# EAGLE board ALU V3.2 (EAGLE 9.6.2)
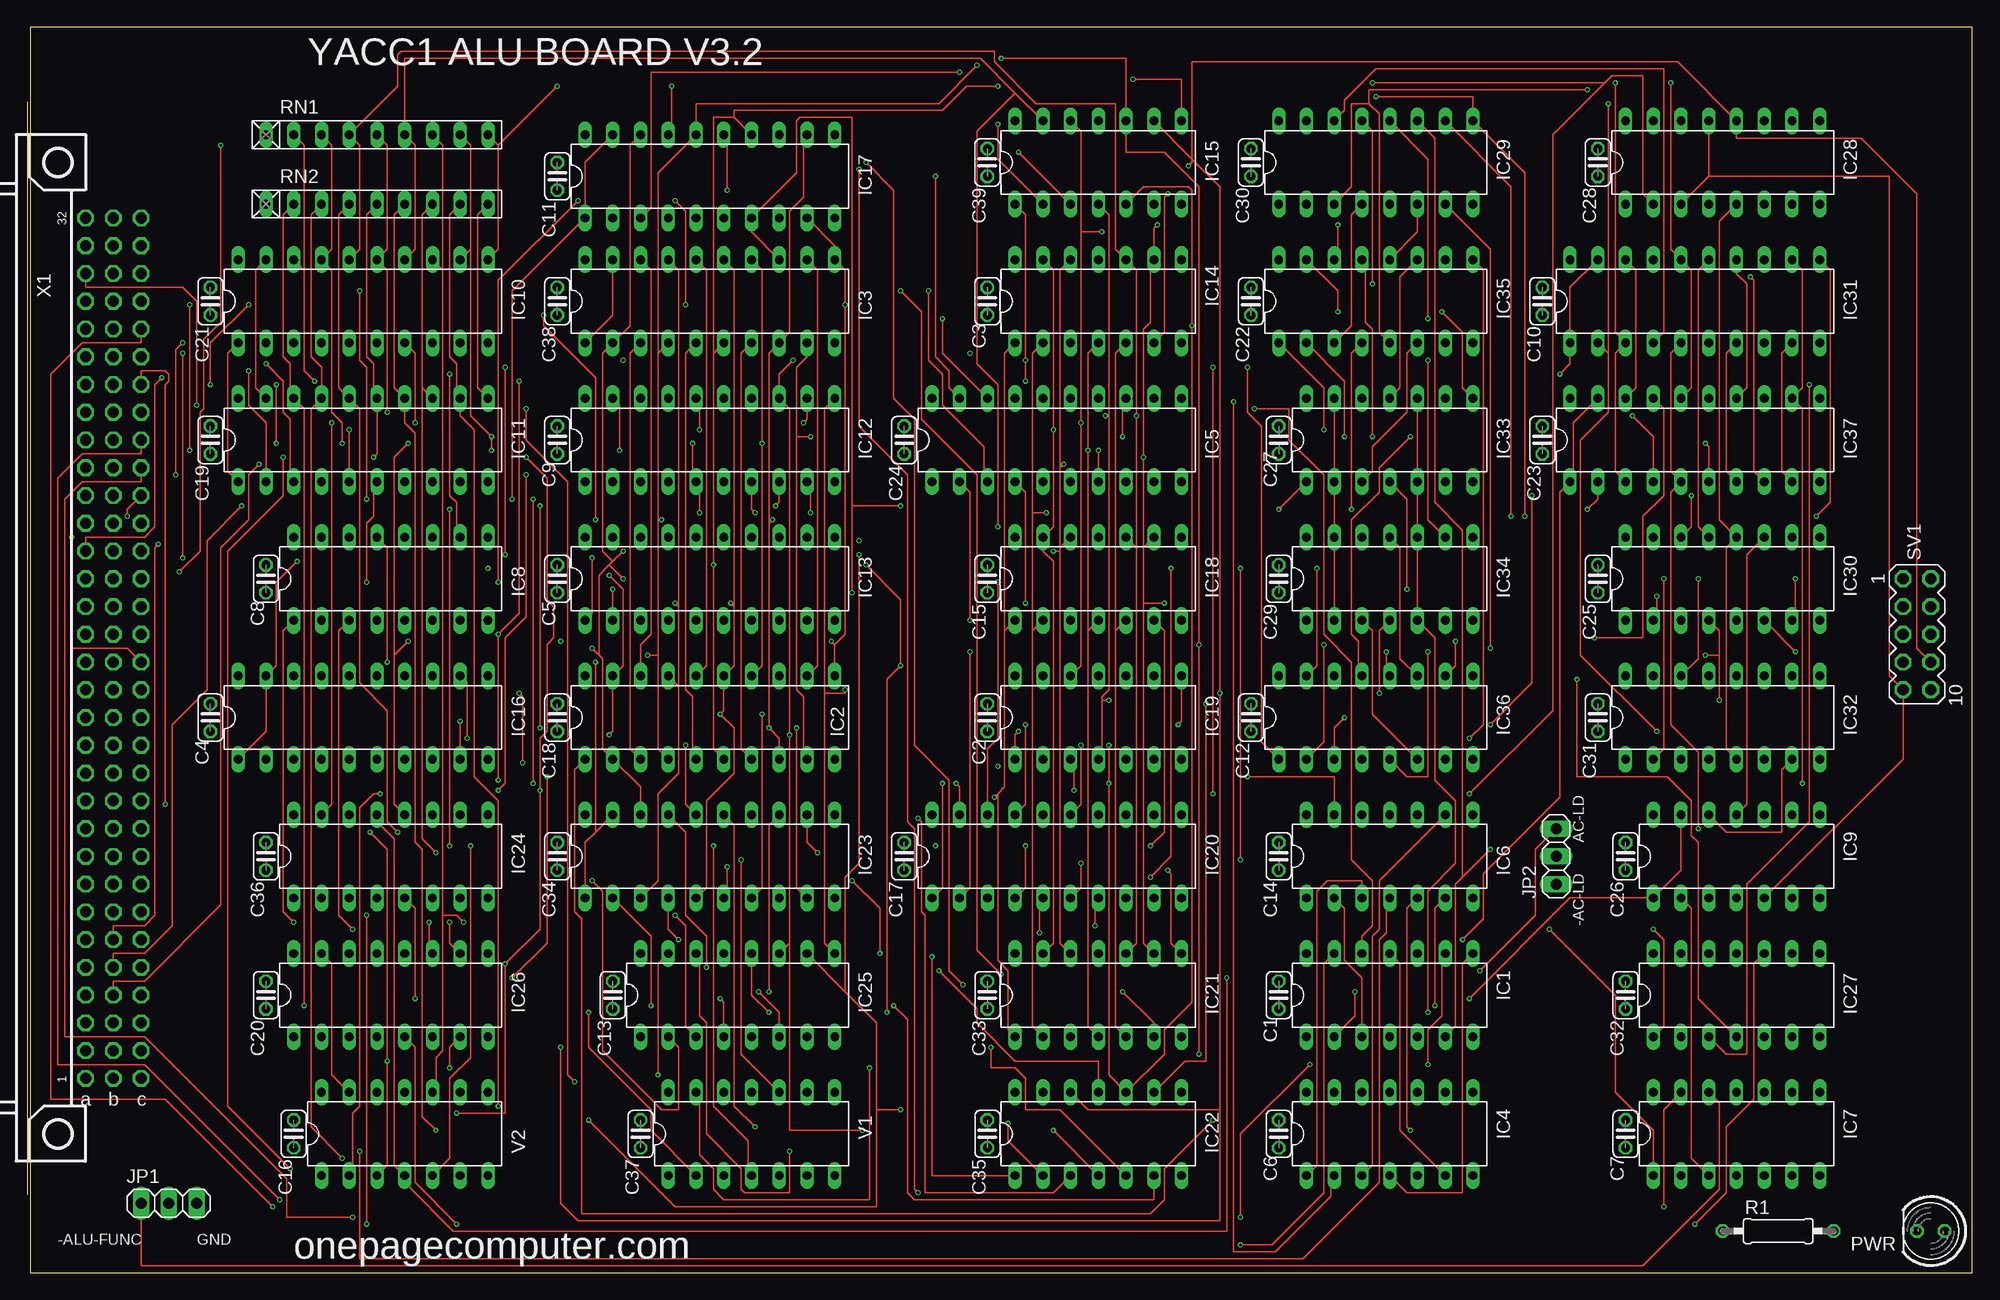
[diagram p9: board, top side]
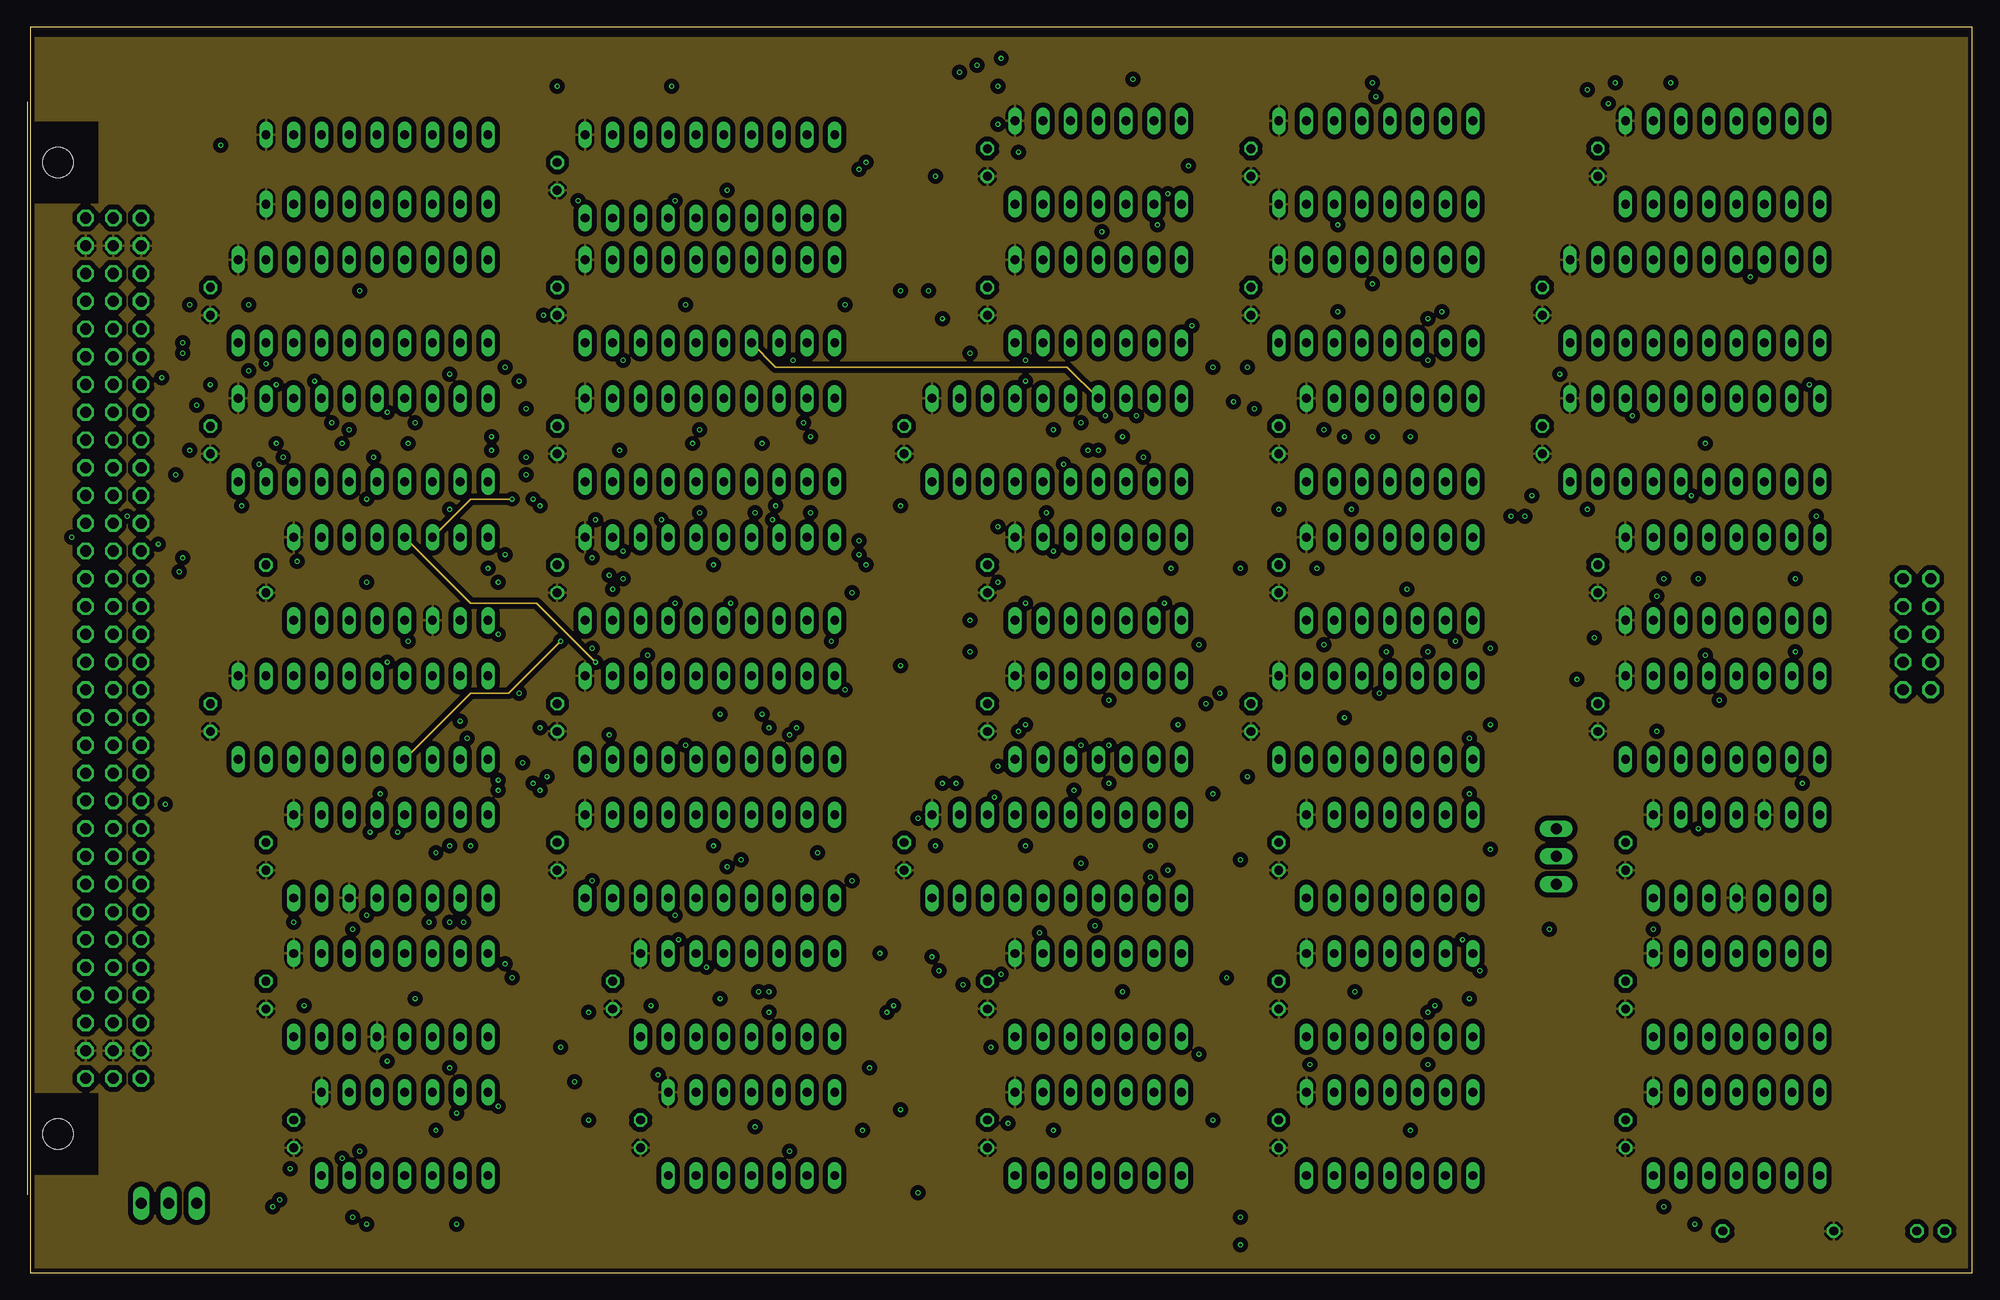
[diagram p10: board, inner layer Route2]
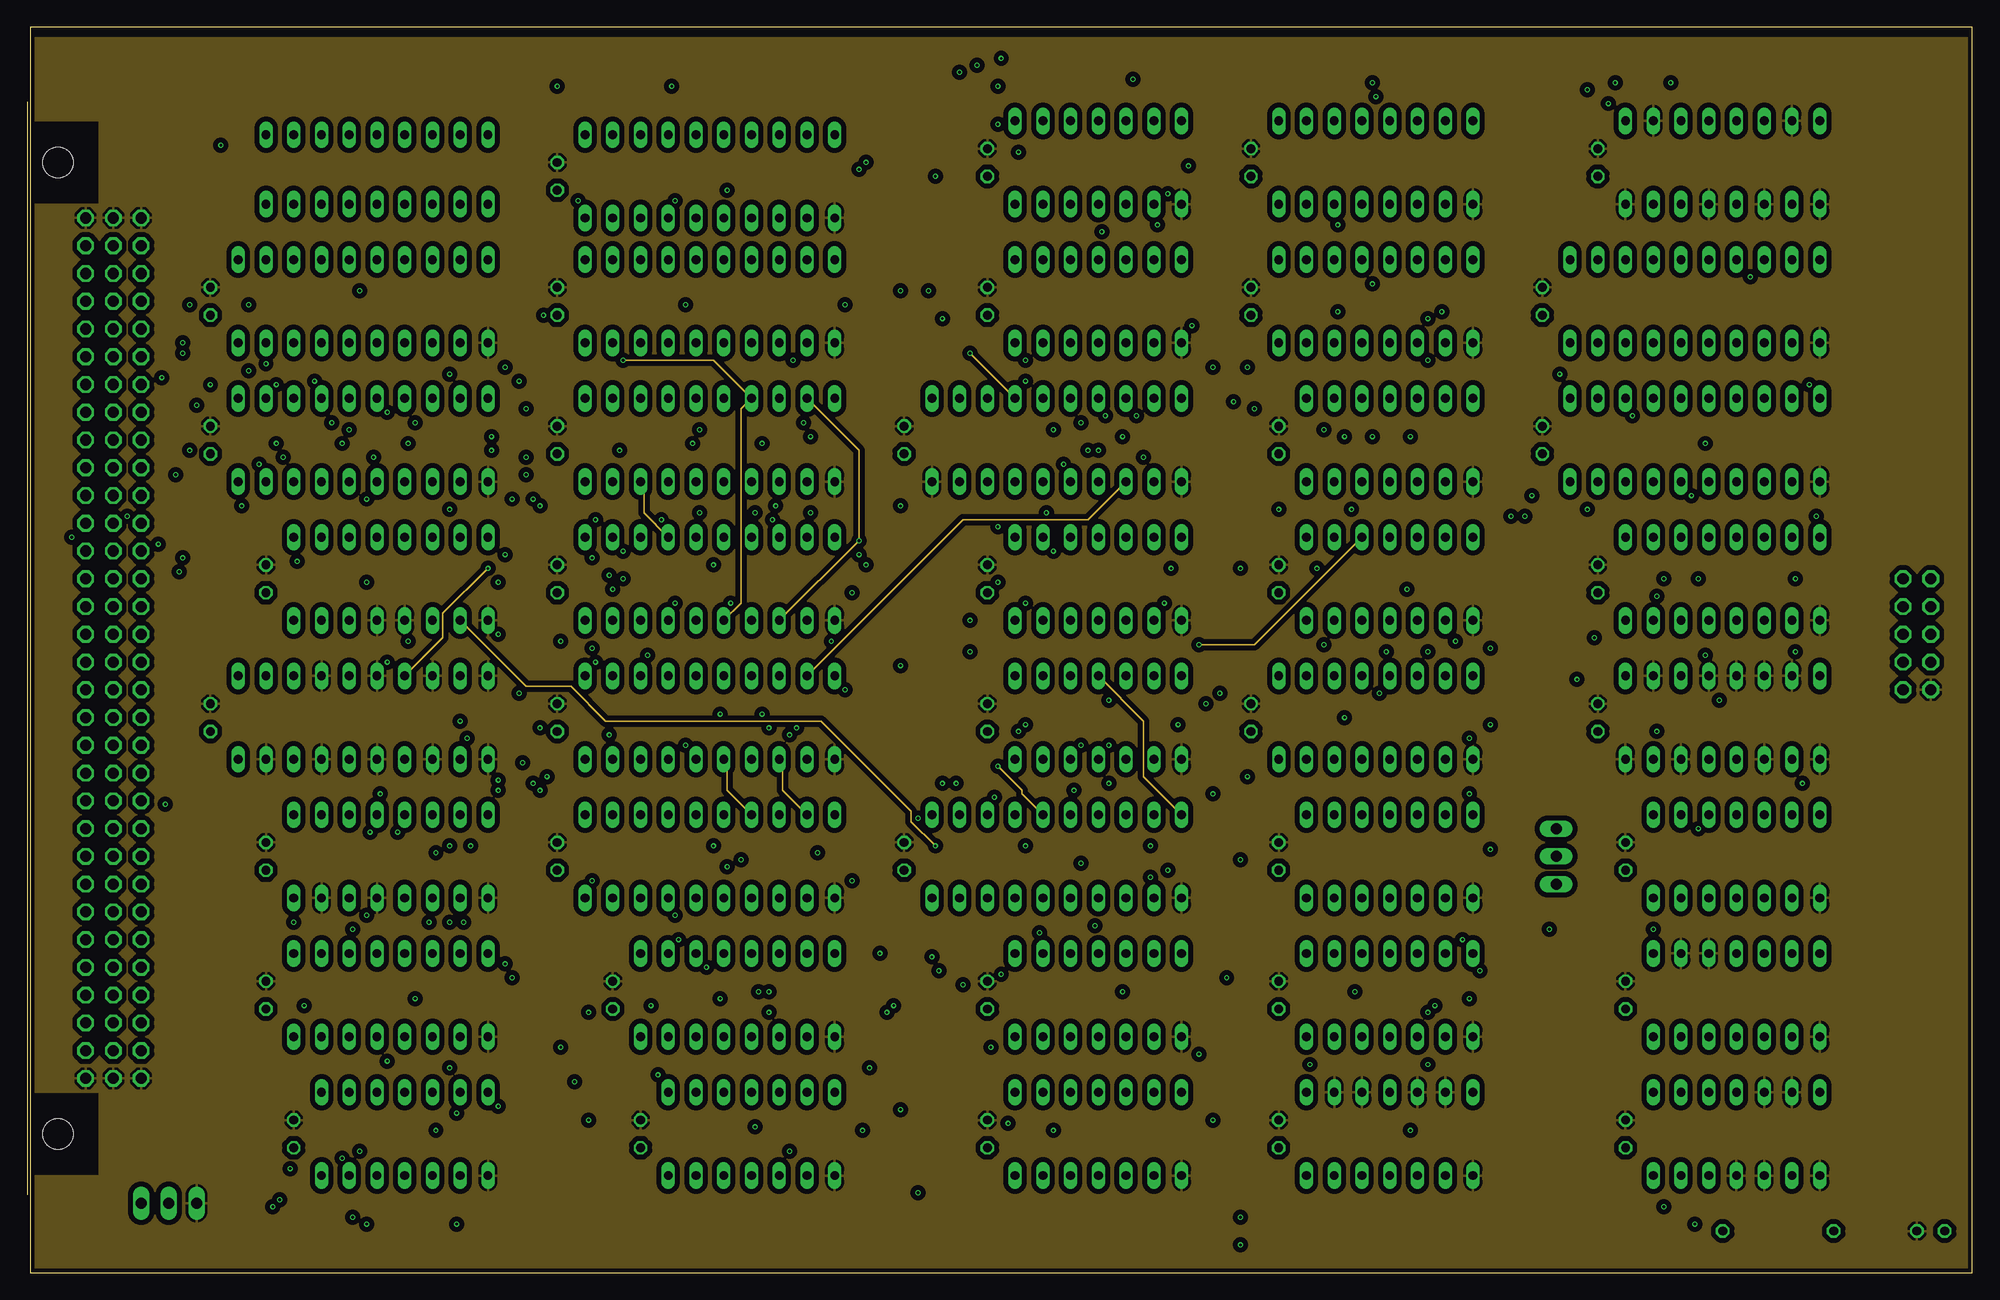
[diagram p11: board, inner layer Route15]
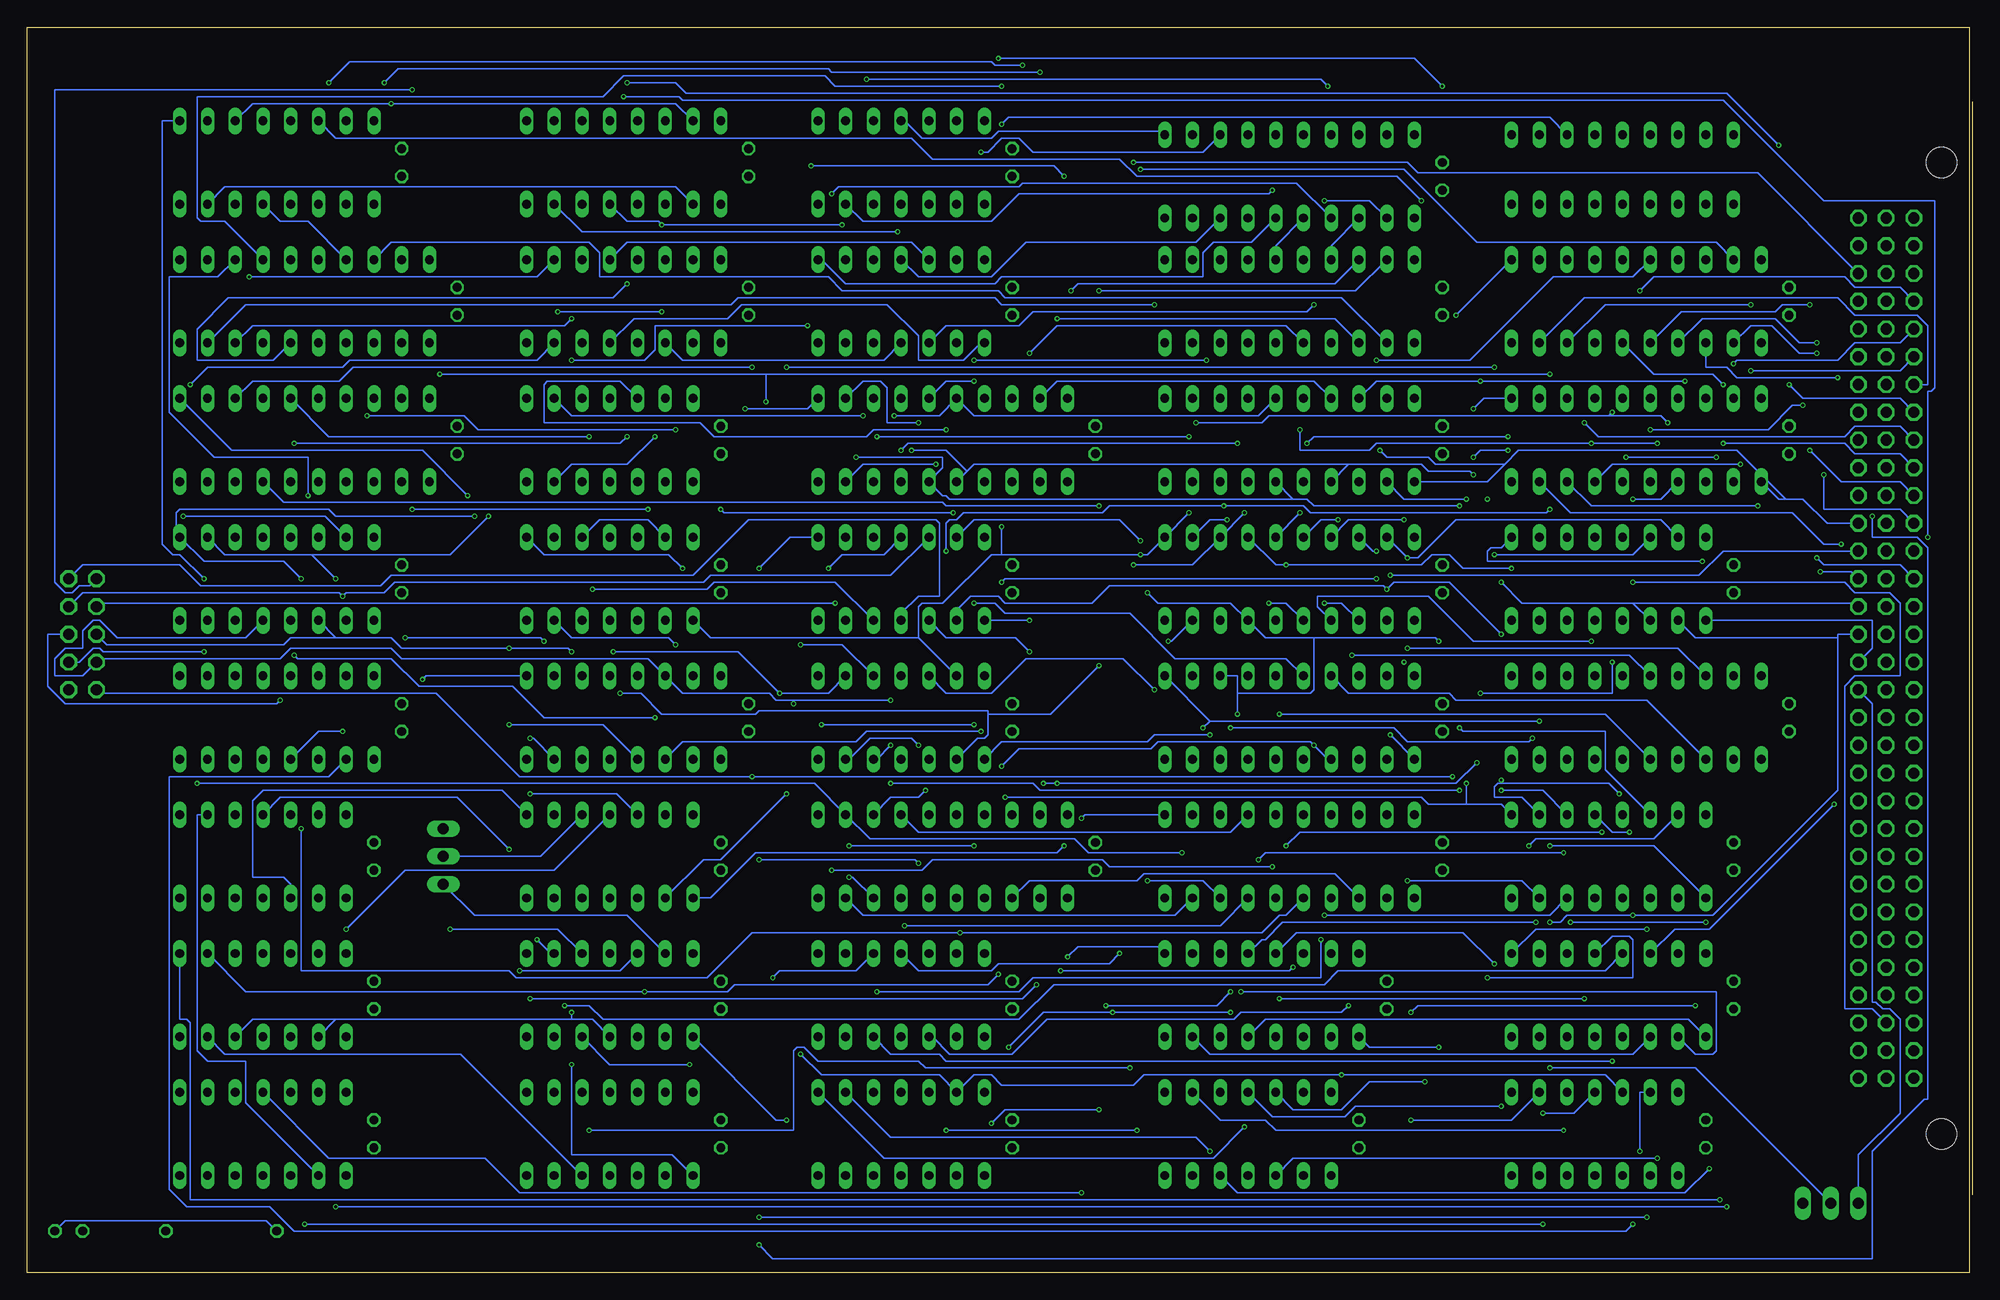
[diagram p12: board, bottom side, seen from below]

Size 177.78 x 113.97 mm. Coordinates in mm from the lower left corner, seen from the top.
Outline: 0,0 177.78,0 177.78,113.97 0,113.97 0,0
Copper layers (1*2*15*16): Top 0.035559375mm / dielectric 0.17018125mm / Route2 0.01778125mm / dielectric 47mil / Route15 0.01778125mm / dielectric 0.17018125mm / Bottom 0.035559375mm
Design rules "oshpark-4layer *": minimum track width 5mil, minimum drill 10mil, track to track 18mil, track to pad 10mil, pad to pad 5mil, via to via 5mil, smd to smd 5mil, copper to edge 15mil, drill to drill 6mil, minimum pad ring 4mil, minimum via ring 4mil, stop-mask expansion 2.5mil, vias tented up to drill 0mil, thermal gap 10mil

## Footprints (pad centres in the part's own frame; a part is rotated, then mirrored left to right if it is on the bottom)
C025-024X044 = drill 0.813 octagon: 1 -1.27,0; 2 1.27,0
DIL14 = drill 0.813 long: 1 -7.62,-3.81; 2 -5.08,-3.81; 3 -2.54,-3.81; 4 0,-3.81; 5 2.54,-3.81; 6 5.08,-3.81; 7 7.62,-3.81; 8 7.62,3.81; 9 5.08,3.81; 10 2.54,3.81; 11 0,3.81; 12 -2.54,3.81; 13 -5.08,3.81; 14 -7.62,3.81
DIL20 = drill 0.813 long: 1 -11.43,-3.81; 2 -8.89,-3.81; 3 -6.35,-3.81; 4 -3.81,-3.81; 5 -1.27,-3.81; 6 1.27,-3.81; 7 3.81,-3.81; 8 6.35,-3.81; 9 8.89,-3.81; 10 11.43,-3.81; 11 11.43,3.81; 12 8.89,3.81; 13 6.35,3.81; 14 3.81,3.81; 15 1.27,3.81; 16 -1.27,3.81; 17 -3.81,3.81; 18 -6.35,3.81; 19 -8.89,3.81; 20 -11.43,3.81
DIL16 = drill 0.813 long: 1 -8.89,-3.81; 2 -6.35,-3.81; 3 -3.81,-3.81; 4 -1.27,-3.81; 5 1.27,-3.81; 6 3.81,-3.81; 7 6.35,-3.81; 8 8.89,-3.81; 9 8.89,3.81; 10 6.35,3.81; 11 3.81,3.81; 12 1.27,3.81; 13 -1.27,3.81; 14 -3.81,3.81; 15 -6.35,3.81; 16 -8.89,3.81
1X03 = drill 1.016 long: 1 -2.54,0; 2 0,0; 3 2.54,0
LED5MM = drill 0.813 octagon: A -1.27,0; K 1.27,0
0207/10 = drill 0.813 octagon: 1 -5.08,0; 2 5.08,0
RN-9 = drill 0.813 long: 1 -10.16,0; 2 -7.62,0; 3 -5.08,0; 4 -2.54,0; 5 0,0; 6 2.54,0; 7 5.08,0; 8 7.62,0; 9 10.16,0
MA05-2 = drill 1.016 octagon: 1 -5.08,-1.27; 2 -5.08,1.27; 3 -2.54,-1.27; 4 -2.54,1.27; 5 0,-1.27; 6 0,1.27; 7 2.54,-1.27; 8 2.54,1.27; 9 5.08,-1.27; 10 5.08,1.27
FABC96R = drill 1.016 octagon: A1 -2.54,39.37; A2 -2.54,36.83; A3 -2.54,34.29; A4 -2.54,31.75; A5 -2.54,29.21; A6 -2.54,26.67; A7 -2.54,24.13; A8 -2.54,21.59; A9 -2.54,19.05; A10 -2.54,16.51; A11 -2.54,13.97; A12 -2.54,11.43; A13 -2.54,8.89; A14 -2.54,6.35; A15 -2.54,3.81; A16 -2.54,1.27; A17 -2.54,-1.27; A18 -2.54,-3.81; A19 -2.54,-6.35; A20 -2.54,-8.89; A21 -2.54,-11.43; A22 -2.54,-13.97; A23 -2.54,-16.51; A24 -2.54,-19.05; A25 -2.54,-21.59; A26 -2.54,-24.13; A27 -2.54,-26.67; A28 -2.54,-29.21; A29 -2.54,-31.75; A30 -2.54,-34.29; A31 -2.54,-36.83; A32 -2.54,-39.37; B1 -5.08,39.37; B2 -5.08,36.83; B3 -5.08,34.29; B4 -5.08,31.75; B5 -5.08,29.21; B6 -5.08,26.67; B7 -5.08,24.13; B8 -5.08,21.59; B9 -5.08,19.05; B10 -5.08,16.51; B11 -5.08,13.97; B12 -5.08,11.43; B13 -5.08,8.89; B14 -5.08,6.35; B15 -5.08,3.81; B16 -5.08,1.27; B17 -5.08,-1.27; B18 -5.08,-3.81; B19 -5.08,-6.35; B20 -5.08,-8.89; B21 -5.08,-11.43; B22 -5.08,-13.97; B23 -5.08,-16.51; B24 -5.08,-19.05; B25 -5.08,-21.59; B26 -5.08,-24.13; B27 -5.08,-26.67; B28 -5.08,-29.21; B29 -5.08,-31.75; B30 -5.08,-34.29; B31 -5.08,-36.83; B32 -5.08,-39.37; C1 -7.62,39.37; C2 -7.62,36.83; C3 -7.62,34.29; C4 -7.62,31.75; C5 -7.62,29.21; C6 -7.62,26.67; C7 -7.62,24.13; C8 -7.62,21.59; C9 -7.62,19.05; C10 -7.62,16.51; C11 -7.62,13.97; C12 -7.62,11.43; C13 -7.62,8.89; C14 -7.62,6.35; C15 -7.62,3.81; C16 -7.62,1.27; C17 -7.62,-1.27; C18 -7.62,-3.81; C19 -7.62,-6.35; C20 -7.62,-8.89; C21 -7.62,-11.43; C22 -7.62,-13.97; C23 -7.62,-16.51; C24 -7.62,-19.05; C25 -7.62,-21.59; C26 -7.62,-24.13; C27 -7.62,-26.67; C28 -7.62,-29.21; C29 -7.62,-31.75; C30 -7.62,-34.29; C31 -7.62,-36.83; C32 -7.62,-39.37 | hole 2.794: 0,-44.456; 0,44.456

## Placement (x,y rotation side)
C1  .1uf  [C025-024X044]  114.3,25.4 90 top
C2  .1uf  [C025-024X044]  87.63,50.8 90 top
C3  .1uf  [C025-024X044]  87.63,88.9 90 top
C4  .1uf  [C025-024X044]  16.51,50.8 90 top
C5  .1uf  [C025-024X044]  48.26,63.5 90 top
C6  .1uf  [C025-024X044]  114.3,12.7 90 top
C7  .1uf  [C025-024X044]  146.05,12.7 90 top
C8  .1uf  [C025-024X044]  21.59,63.5 90 top
C9  .1uf  [C025-024X044]  48.26,76.2 90 top
C10  .1uf  [C025-024X044]  138.43,88.9 90 top
C11  .1uf  [C025-024X044]  48.26,100.33 90 top
C12  .1uf  [C025-024X044]  111.76,50.8 90 top
C13  .1uf  [C025-024X044]  53.34,25.4 90 top
C14  .1uf  [C025-024X044]  114.3,38.1 90 top
C15  .1uf  [C025-024X044]  87.63,63.5 90 top
C16  .1uf  [C025-024X044]  24.13,12.7 90 top
C17  .1uf  [C025-024X044]  80.01,38.1 90 top
C18  .1uf  [C025-024X044]  48.26,50.8 90 top
C19  .1uf  [C025-024X044]  16.51,76.2 90 top
C20  .1uf  [C025-024X044]  21.59,25.4 90 top
C21  ,1uf  [C025-024X044]  16.51,88.9 90 top
C22  .1uf  [C025-024X044]  111.76,88.9 90 top
C23  .1uf  [C025-024X044]  138.43,76.2 90 top
C24  .1uf  [C025-024X044]  80.01,76.2 90 top
C25  .1uf  [C025-024X044]  143.51,63.5 90 top
C26  .1uf  [C025-024X044]  146.05,38.1 90 top
C27  .1uf  [C025-024X044]  114.3,76.2 90 top
C28  .1uf  [C025-024X044]  143.51,101.6 90 top
C29  .1uf  [C025-024X044]  114.3,63.5 90 top
C30  .1uf  [C025-024X044]  111.76,101.6 90 top
C31  .1uf  [C025-024X044]  143.51,50.8 90 top
C32  .1uf  [C025-024X044]  146.05,25.4 90 top
C33  .1uf  [C025-024X044]  87.63,25.4 90 top
C34  .1uf  [C025-024X044]  48.26,38.1 90 top
C35  .1uf  [C025-024X044]  87.63,12.7 90 top
C36  .1uf  [C025-024X044]  21.59,38.1 90 top
C37  .1uf  [C025-024X044]  55.88,12.7 90 top
C38  .1uf  [C025-024X044]  48.26,88.9 90 top
C39  .1uf  [C025-024X044]  87.63,101.6 90 top
IC1  74ALS04N  [DIL14]  124.46,25.4 0 top
IC2  74LS240N  [DIL20]  62.23,50.8 0 top
IC3  74LS244N  [DIL20]  62.23,88.9 0 top
IC4  74LS00N  [DIL14]  124.46,12.7 0 top
IC5  74LS374N  [DIL20]  93.98,76.2 0 top
IC6  74ALS08N  [DIL14]  124.46,38.1 0 top
IC7  74LS32N  [DIL14]  156.21,12.7 0 top
IC8  74LS138N  [DIL16]  33.02,63.5 0 top
IC9  74LS74N  [DIL14]  156.21,38.1 0 top
IC10  74LS245N  [DIL20]  30.48,88.9 0 top
IC11  74LS245N  [DIL20]  30.48,76.2 0 top
IC12  74LS244N  [DIL20]  62.23,76.2 0 top
IC13  74LS244N  [DIL20]  62.23,63.5 0 top
IC14  74LS86N  [DIL14]  97.79,88.9 0 top
IC15  74LS86N  [DIL14]  97.79,101.6 0 top
IC16  74LS244N  [DIL20]  30.48,50.8 0 top
IC17  74LS244N  [DIL20]  62.23,100.33 0 top
IC18  74LS08N  [DIL14]  97.79,63.5 0 top
IC19  74LS08N  [DIL14]  97.79,50.8 0 top
IC20  74LS244N  [DIL20]  93.98,38.1 0 top
IC21  74LS32N  [DIL14]  97.79,25.4 0 top
IC22  74LS32N  [DIL14]  97.79,12.7 0 top
IC23  74LS244N  [DIL20]  62.23,38.1 0 top
IC24  74LS85N  [DIL16]  33.02,38.1 0 top
IC25  74LS85N  [DIL16]  64.77,25.4 0 top
IC26  74LS251N  [DIL16]  33.02,25.4 0 top
IC27  74LS86N  [DIL14]  156.21,25.4 0 top
IC28  74LS153N  [DIL16]  154.94,101.6 0 top
IC29  74LS194N  [DIL16]  123.19,101.6 0 top
IC30  74LS194N  [DIL16]  154.94,63.5 0 top
IC31  74LS244N  [DIL20]  152.4,88.9 0 top
IC32  74LS153N  [DIL16]  154.94,50.8 0 top
IC33  74LS86N  [DIL14]  124.46,76.2 0 top
IC34  74LS86N  [DIL14]  124.46,63.5 0 top
IC35  74LS283N  [DIL16]  123.19,88.9 0 top
IC36  74LS283N  [DIL16]  123.19,50.8 0 top
IC37  74LS244N  [DIL20]  152.4,76.2 0 top
JP1  [1X03]  12.7,6.35 0 top
JP2  [1X03]  139.7,38.1 90 top
PWR  [LED5MM]  173.99,3.81 180 top
R1  330  [0207/10]  160.02,3.81 0 top
RN1  10k  [RN-9]  31.75,104.14 0 top
RN2  10k  [RN-9]  31.75,97.79 0 top
SV1  [MA05-2]  172.72,58.42 270 top
V1  744078N  [DIL14]  66.04,12.7 0 top
V2  744078N  [DIL14]  34.29,12.7 0 top
X1  FABC96R  [FABC96R]  2.54,57.15 180 top

## Tracks (layer width: path | path; a pad name or v marks a point on that pad's centre or on a via)
-AC-LD  (via drill 0.25)
  Top 0.127: X1.C22 8.89,69.85 v8.89,69.22 | v110.81,2.54 113.67,2.54 118.43,7.3 118.43,28.26 IC1.13
  Bottom 0.127: IC1.13 122.87,32.7 136.84,32.7 JP2.1 | v8.89,69.22 8.89,67.31 4.76,67.31 3.81,66.36 3.81,15.88 4.13,15.88 8.89,11.11 8.89,1.27 109.54,1.27 v110.81,2.54
-AC-LD-INV  (via drill 0.25)
  Top 0.127: v53.02,49.21 53.34,49.53 IC2.19 54.29,55.56 54.29,62.55 v53.02,63.82 | v108.27,13.97 103.82,9.53 103.82,6.67 102.55,5.4 50.48,5.4 50.48,32.38 49.85,33.02 49.85,46.04 IC2.1
  Bottom 0.127: v53.02,49.21 IC2.1 | IC1.1 109.22,13.97 v108.27,13.97 | X1.C20 22.54,66.04 24.77,63.82 v53.02,63.82
-AC-RD  (via drill 0.25)
  Top 0.127: IC12.19 53.98,79.38 v53.98,75.25 | IC10.1 18.1,84.14 18.1,73.34 IC11.1
  Bottom 0.127: IC11.1 17.46,70.8 16.83,70.8 | 16.83,70.8 15.24,70.8 13.02,68.58 X1.C21 | IC12.1 44.13,72.39 42.55,73.98 | 42.55,73.98 41.27,75.25 21.27,75.25 16.83,70.8 | v53.98,75.25 53.34,74.61 49.53,74.61 48.9,73.98 42.55,73.98
-ADD  (via drill 0.25)
  Route15 0.127: IC8.7 45.4,53.66 49.53,53.66 52.7,50.48 72.39,50.48 80.64,42.23 80.64,41.27 v82.87,39.05
  Bottom 0.127: v82.87,39.05 83.5,38.42 111.12,38.42 115.25,34.29 IC6.1
-ADD/SUB  (via drill 0.25)
  Top 0.127: IC37.19 141.29,77.79 141.29,72.71 IC37.1 140.02,71.44 140.02,43.5 133.03,36.51 133.03,32.38 v131.13,30.48 | IC4.1 117.79,9.84 117.79,34.92 118.75,35.88 121.92,35.88 IC6.3 | IC1.9 129.22,28.89 129.22,23.5 127.95,22.23 v127.95,19.05
  Bottom 0.127: v127.95,19.05 127.95,10.79 118.75,10.79 IC4.1 | v131.13,30.48 129.86,29.21 IC1.9
-ALU-FUNC
  Top 0.127: IC7.12 154.62,15.56 154.62,7.62 147.64,0.64 10.16,0.64 JP1.1
  Bottom 0.127: X1.C15 8.89,52.07 8.89,24.77 8.57,24.77 7.94,24.13 7.3,24.13 6.35,23.18 6.35,14.61 10.16,10.79 JP1.1
-ALU-IO-EN  (via drill 0.25)
  Top 0.127: IC11.19 20.64,80.96 20.64,91.76 IC10.19 | v81.28,7.3 80.96,7.62 80.96,40.64 80.33,41.27 80.33,73.03 75.88,77.47 v75.88,100.97
  Bottom 0.127: IC7.11 150.18,10.48 135.89,10.48 132.72,7.3 v81.28,7.3 | v75.88,100.97 51.75,100.97 45.09,94.3 23.18,94.3 IC10.19
-AND  (via drill 0.25)
  Top 0.127: IC8.13 32.7,66.36 v32.7,55.88 | v44.77,53.02 45.09,52.7 v45.09,46.67 | v84.77,44.77 85.09,44.45 IC20.19 | IC20.1 83.5,35.24 v83.5,44.77
  Bottom 0.127: v32.7,55.88 32.7,53.02 v44.77,53.02 | v45.09,46.67 46.99,44.77 v83.5,44.77 v84.77,44.77
-BUS-EN  (via drill 0.25)
  Top 0.127: IC7.13 149.54,14.92 v149.54,6.03 | v22.23,6.03 12.38,15.88 1.91,15.88 1.91,82.23 4.76,85.09 10.16,85.09 X1.C28
  Bottom 0.127: v22.23,6.03 v149.54,6.03
-DATA  (via drill 0.25)
  Top 0.127: IC13.1 51.44,60.33 v51.44,65.41
  Bottom 0.127: IC13.19 v51.44,65.41 50.48,65.41 46.99,68.9 28.26,68.9 IC8.15
-OR  (via drill 0.25)
  Top 0.127: IC23.1 50.8,39.37 51.75,40.32 | IC23.19 51.75,40.32 | 51.75,40.32 v51.75,55.88
  Route2 0.127: IC8.12 40.32,61.28 46.35,61.28 v51.75,55.88
-RESET  (via drill 0.25)
  Top 0.127: IC9.13 151.13,36.83 IC9.1 140.97,34.29 v131.76,25.08 | v76.52,101.6 79.06,99.06 79.06,80.01 80.96,78.11 80.96,48.26 84.14,45.09 84.14,27.62 v85.41,26.35
  Bottom 0.127: X1.C30 19.37,100.65 50.48,100.65 51.44,101.6 v76.52,101.6 | v85.41,26.35 86.68,25.08 v131.76,25.08
-SHIFT  (via drill 0.25)
  Top 0.127: IC8.10 39.05,67.63 39.05,70.48 38.42,71.12 v38.42,82.23 | v140.02,82.23 140.97,83.19 IC31.1 140.97,90.17 IC31.19 | IC4.2 119.06,8.57 119.06,6.99 113.98,1.91 110.17,1.91 v110.17,79.69
  Bottom 0.127: v140.02,82.23 110.17,82.23 | 110.17,82.23 v38.42,82.23 | 110.17,82.23 v110.17,79.69
-SR-LD  (via drill 0.25)
  Top 0.127: v117.16,19.05 110.81,12.7 v110.81,5.08 | v29.53,5.08 23.5,5.08 23.5,8.57 10.48,21.59 3.17,21.59 3.17,70.8 4.76,72.39 10.16,72.39 X1.C23
  Bottom 0.127: IC1.5 124.46,19.05 v117.16,19.05 | v29.53,5.08 v110.81,5.08
-SUB  (via drill 0.25)
  Top 0.127: v43.5,82.87 v43.5,65.72 | v108.27,43.81 v108.27,82.87 | IC1.3 121.92,26.99 120.33,28.57 120.33,33.34 IC6.2
  Bottom 0.127: IC8.14 30.8,65.72 v43.5,65.72 | v108.27,82.87 v43.5,82.87 | v108.27,43.81 114.3,37.78 115.89,37.78 IC6.2
-XOR  (via drill 0.25)
  Top 0.127: v44.13,70.8 44.13,89.85 IC17.1 50.8,101.6 IC17.19
  Route2 0.127: IC8.11 40.32,70.8 v44.13,70.8
-ZERO  (via drill 0.25)
  Top 0.127: IC16.1 21.59,49.53 IC16.19 22.54,55.56 22.54,63.18 v24.45,65.09
  Bottom 0.127: IC8.9 42.86,66.36 43.81,66.36 44.13,66.04 44.13,65.09 v24.45,65.09
AC-LD  (via drill 0.25)
  Top 0.127: v132.72,27.62 137.79,32.7 137.79,38.73 JP2.3 | v112.08,79.06 115.25,79.06 115.25,76.2 118.43,73.03 118.43,58.42 120.97,55.88 120.97,37.78 122.87,35.88 122.87,31.75 121.92,30.8 IC1.12
  Bottom 0.127: IC1.12 123.51,27.62 v132.72,27.62 | IC5.11 106.36,79.06 v112.08,79.06
AC-LD-INV  (via drill 0.25)
  Top 0.127: IC3.1 53.34,87.63 IC3.19 | IC1.2 121.28,23.5 v121.28,25.72 | v79.69,89.85 81.6,87.95 81.6,78.11 86.68,73.03 86.68,29.53 v88.9,27.3
  Bottom 0.127: IC27.9 157.8,25.72 v121.28,25.72 113.67,25.72 113.03,26.35 89.85,26.35 v88.9,27.3 | IC3.19 56.2,89.85 v79.69,89.85
ACI-DATA0  (via drill 0.25)
  Top 0.127: IC2.18 55.88,57.47 56.83,58.42 56.83,91.76 IC3.18 | IC5.3 87.31,72.71 87.31,75.56 83.5,79.38 83.5,82.23 82.23,83.5 v82.23,89.85
  Bottom 0.127: v82.23,89.85 81.6,90.49 58.1,90.49 IC3.18
ACI-DATA1  (via drill 0.25)
  Top 0.127: IC2.16 61.91,55.56 61.91,91.76 IC3.16 | IC5.4 91.12,71.44 v91.12,61.28
  Bottom 0.127: v91.12,61.28 89.22,61.28 88.27,60.33 76.83,60.33 72.71,56.2 62.55,56.2 IC2.16
ACI-DATA2  (via drill 0.25)
  Top 0.127: IC2.14 66.99,55.56 v66.99,75.88 66.99,91.76 IC3.14 | v97.79,75.25 IC5.7
  Bottom 0.127: v97.79,75.25 97.16,75.88 v66.99,75.88
ACI-DATA3
  Top 0.127: IC2.12 72.07,55.56 72.07,91.76 IC3.12
  Route15 0.127: IC5.8 96.84,68.9 85.41,68.9 IC2.12
ACI-DATA4  (via drill 0.25)
  Top 0.127: IC2.9 70.8,47.31 70.8,52.7 70.17,53.34 70.17,76.52 | 70.17,76.52 70.17,82.87 71.12,83.82 IC3.9 | IC5.13 100.01,79.69 v100.01,76.52 | 70.17,76.52 v71.44,76.52
  Bottom 0.127: v71.44,76.52 v100.01,76.52
ACI-DATA5
  Top 0.127: IC2.7 65.09,47.94 65.09,84.14 IC3.7
  Route2 0.127: IC5.14 94.93,82.87 68.26,82.87 IC3.7
ACI-DATA6  (via drill 0.25)
  Top 0.127: IC2.5 60.64,47.31 60.64,52.7 60.01,53.34 60.01,84.14 IC3.5
  Route15 0.127: v86.04,84.14 IC5.17
  Bottom 0.127: v86.04,84.14 83.5,86.68 62.55,86.68 IC3.5
ACI-DATA7  (via drill 0.25)
  Top 0.127: IC2.3 54.93,47.94 54.93,84.14 IC3.3 | IC5.18 83.5,84.14 v83.5,87.31
  Bottom 0.127: v83.5,87.31 58.1,87.31 IC3.3
ACO-DATA0  (via drill 0.25)
  Top 0.127: IC35.5 123.51,86.04 123.51,106.05 122.56,107 | 122.56,107 120.97,107 120.97,99.38 IC29.3 | v142.56,108.27 122.56,108.27 122.56,107 | 88.58,43.81 89.22,44.45 89.22,58.74 | 88.58,43.81 v88.27,43.5 | IC18.1 89.22,58.74 | v46.04,44.77 v46.04,70.8 | IC5.2 86.04,71.44 v86.04,59.69 | IC21.1 89.53,22.23 89.53,27.62 88.58,28.57 88.58,43.81 | IC14.1 89.22,84.14 89.22,58.74
  Bottom 0.127: SV1.1 172.09,62.87 173.04,62.87 173.67,62.23 174.31,62.23 175.26,63.18 175.26,108.27 v142.56,108.27 | IC24.9 42.86,42.86 46.04,42.86 | 46.04,42.86 49.53,42.86 50.16,43.5 v88.27,43.5 | IC12.2 51.75,70.8 v46.04,70.8 | 46.04,42.86 v46.04,44.77 | IC18.1 v86.04,59.69 | IC35.5 122.24,87.31 113.67,87.31 112.39,88.58 99.06,88.58 96.2,85.72 96.2,83.5 92.08,83.5 90.49,85.09 IC14.1
ACO-DATA1  (via drill 0.25)
  Top 0.127: v42.86,44.13 43.5,44.77 43.5,58.1 45.4,60.01 v45.4,73.03 | IC35.3 120.97,86.68 120.97,96.84 IC29.4 | IC21.4 96.84,22.54 96.84,58.74 | IC18.4 96.84,58.74 | IC14.4 96.84,84.14 v96.84,75.25 96.84,58.74
  Bottom 0.127: IC24.11 39.05,44.13 v42.86,44.13 | v45.4,73.03 45.72,73.34 49.53,73.34 50.16,73.98 56.83,73.98 | IC12.4 56.83,73.98 | 91.76,73.34 91.12,73.98 56.83,73.98 | 91.76,73.34 IC5.5 | SV1.2 172.72,64.77 163.83,64.77 161.93,62.87 145.41,62.87 144.46,63.82 116.84,63.82 111.76,68.9 94.61,68.9 94.3,68.58 94.3,61.91 96.2,61.91 97.79,60.33 IC18.4 | IC35.3 117.79,83.5 99.38,83.5 IC14.4 | 91.76,73.34 93.66,75.25 v96.84,75.25
ACO-DATA2  (via drill 0.25)
  Top 0.127: v46.67,70.17 v46.67,49.85 | IC35.14 119.7,93.03 v119.7,95.89 | IC21.9 101.92,30.16 101.92,61.28 | 101.92,66.36 101.92,61.28 | IC18.9 101.92,66.36 | 101.92,66.36 v101.92,74.61 101.92,86.36 102.55,87 102.55,92.39 IC14.9 102.87,95.57 v103.19,95.89 | 101.92,61.28 v103.82,61.28
  Bottom 0.127: IC24.14 33.34,46.04 33.34,49.53 46.35,49.53 v46.67,49.85 | v46.67,70.17 60.01,70.17 60.64,70.8 61.91,70.8 | IC12.6 61.91,70.8 | 61.91,70.8 93.34,70.8 93.66,71.12 93.98,71.12 IC5.6 93.98,73.66 93.98,74.61 v101.92,74.61 | IC29.5 122.87,96.2 120.02,96.2 v119.7,95.89 v103.19,95.89 | SV1.3 171.13,61.28 v103.82,61.28
ACO-DATA3  (via drill 0.25)
  Top 0.127: v38.42,69.85 v38.42,39.05 | v68.26,70.17 68.58,70.48 IC12.8 | IC30.2 148.91,60.01 v148.91,61.91 | IC35.12 127,95.25 IC29.6 | IC21.12 94.3,30.16 94.3,66.04 | 94.3,66.36 94.3,66.04 | IC18.12 94.3,66.36 | 94.3,73.66 v94.61,73.98 | 94.3,66.36 94.3,73.66 | IC14.12 94.3,91.76 94.3,73.66 | 94.3,66.04 v93.66,66.04
  Bottom 0.127: IC24.1 28.89,39.05 v38.42,39.05 | v38.42,69.85 38.73,69.53 60.33,69.53 60.96,70.17 v68.26,70.17 78.74,70.17 79.38,69.53 92.08,69.53 92.71,68.9 93.34,68.9 93.66,68.58 v93.66,66.04 | SV1.4 172.72,62.23 149.22,62.23 v148.91,61.91 148.59,62.23 145.1,62.23 144.15,63.18 115.89,63.18 115.25,63.82 98.74,63.82 IC18.12 | IC5.9 101.28,73.98 v94.61,73.98 | IC35.12 122.87,94.3 96.84,94.3 IC14.12
ACO-DATA4  (via drill 0.25)
  Top 0.127: IC25.9 72.71,30.16 72.71,53.02 | 72.71,53.02 72.71,79.06 IC12.11 | IC22.1 82.55,8.89 v82.55,28.89 | IC36.5 126.05,45.4 127.95,45.4 v127.95,56.83 | IC19.12 96.2,55.56 v96.2,77.79 96.2,95.25 | 96.2,95.25 96.2,104.46 IC15.12 | 96.2,95.25 v98.11,95.25 | v133.67,57.15 133.67,93.66 IC29.7 | 72.71,53.02 74.61,53.02 v74.61,53.34
  Bottom 0.127: v82.55,28.89 81.6,29.84 74.3,29.84 IC25.9 | v127.95,56.83 128.27,57.15 v133.67,57.15 143.51,57.15 144.46,58.1 149.54,58.1 | IC30.3 149.54,58.1 | SV1.5 170.5,57.47 154.31,57.47 153.67,58.1 149.54,58.1 | IC5.12 101.28,81.6 99.69,81.6 99.06,80.96 99.06,77.79 v96.2,77.79 | IC29.7 127,95.25 v98.11,95.25 | v74.61,53.34 77.47,56.2 86.36,56.2 89.53,53.02 93.66,53.02 IC19.12
ACO-DATA5  (via drill 0.25)
  Top 0.127: IC30.4 154.62,58.74 154.62,56.52 | v154.62,52.39 154.62,56.52 | IC15.1 91.12,96.84 v91.12,83.5 v91.12,81.6 | 69.53,30.16 IC25.11 | 69.53,30.16 v69.53,49.21 69.53,79.06 IC12.13 68.58,82.23 v69.85,83.5 | v93.66,13.02 IC22.4 | v76.2,13.02 69.53,13.02 69.53,30.16 | v90.49,49.53 90.17,49.21 IC19.1 | v153.35,56.52 154.62,56.52 | v120.33,50.8 119.38,49.85 IC36.3
  Bottom 0.127: v154.62,52.39 154.94,52.07 174.31,52.07 175.9,53.66 175.9,58.42 SV1.6 | v91.12,81.6 93.66,81.6 IC5.15 | v76.2,13.02 v93.66,13.02 | IC19.1 88.58,48.58 75.25,48.58 74.61,49.21 v69.53,49.21 | IC36.3 117.79,48.58 101.92,48.58 100.97,49.53 v90.49,49.53 | v69.85,83.5 v91.12,83.5 | v153.35,56.52 153.03,56.2 144.46,56.2 141.92,53.66 133.35,53.66 130.49,50.8 v120.33,50.8
ACO-DATA6  (via drill 0.25)
  Top 0.127: IC25.14 61.28,28.89 61.28,23.5 61.91,22.86 61.91,12.7 65.09,9.53 65.09,7.62 65.41,7.3 69.53,7.3 v69.53,11.11 | IC19.4 98.11,47.31 98.11,52.39 | 98.11,52.39 98.11,52.7 98.74,53.34 98.74,78.42 | 98.74,78.42 98.74,96.84 IC15.4 | 98.11,52.39 v98.74,52.39 | 98.74,78.42 v98.42,78.42 | IC22.9 105.73,19.37 107.63,19.37 v107.63,52.07
  Bottom 0.127: v69.53,11.11 70.8,12.38 98.74,12.38 IC22.9 | IC12.15 65.09,78.42 91.12,78.42 IC5.16 94.3,78.42 v98.42,78.42 | IC30.5 157.8,58.1 169.54,58.1 171.13,59.69 171.77,59.69 172.72,58.74 172.72,57.15 174.31,57.15 175.26,56.2 175.26,54.61 172.72,54.61 SV1.7 171.13,56.2 154.62,56.2 153.67,57.15 144.46,57.15 143.51,56.2 120.97,56.2 IC36.14 117.79,53.02 109.86,53.02 109.22,52.39 107.63,52.39 | v98.74,52.39 107.63,52.39 | 107.63,52.39 v107.63,52.07
ACO-DATA7  (via drill 0.25)
  Top 0.127: v161.61,56.83 IC30.6 | IC22.12 96.84,14.92 108.9,14.92 | 108.9,14.92 v108.9,53.02 108.9,99.38 106.36,101.92 | v48.58,20.64 48.58,6.35 50.16,4.76 108.9,4.76 108.9,14.92 | IC36.12 124.14,54.93 v124.14,56.83 | 106.36,101.92 IC15.9 | 106.36,101.92 106.36,110.81 150.81,110.81 IC28.12 156.21,103.82 167.64,103.82 172.72,98.74 172.72,57.15 SV1.8 | IC5.19 84.14,80.96 84.14,82.55 82.87,83.82 v82.87,100.33 | v106.05,101.28 106.36,101.6 106.36,101.92
  Bottom 0.127: IC12.17 60.01,81.6 83.5,81.6 IC5.19 | v161.61,56.83 170.81,56.83 171.13,57.15 171.77,57.15 173.04,55.88 SV1.8 | IC19.9 104.46,53.02 v108.9,53.02 112.71,56.83 v124.14,56.83 | IC25.1 54.93,20.64 v48.58,20.64 | v82.87,100.33 83.82,101.28 v106.05,101.28
ALU0  (via drill 0.25)
  Top 0.127: IC26.11 36.51,29.53 v36.51,32.07 | v24.13,32.07 23.18,33.02 23.18,58.74 IC8.1 | IC32.14 152.72,56.2 v152.72,63.5 | v136.84,69.22 136.84,100.65 IC29.9 132.08,107.63 v123.19,107.63 | X1.C16 8.89,57.15 3.81,57.15 v3.81,67.31
  Bottom 0.127: v24.13,32.07 v36.51,32.07 | X1.C16 8.89,57.15 8.89,59.69 IC8.1 | v152.72,63.5 154.31,65.09 161.61,65.09 IC30.9 164.15,67.31 164.15,69.53 163.83,69.85 150.18,69.85 149.54,69.22 v136.84,69.22 | v3.81,67.31 3.81,80.64 3.49,80.64 3.17,80.96 3.17,98.11 13.34,98.11 22.54,107.31 117.79,107.31 118.11,107.63 v123.19,107.63
ALU1  (via drill 0.25)
  Top 0.127: IC26.10 38.42,30.16 v38.42,32.07 | IC32.2 149.54,47.94 v149.54,63.5 | IC29.10 135.57,99.38 v135.57,69.22 | v30.8,4.45 v30.8,32.7
  Bottom 0.127: v38.42,32.07 37.47,32.07 36.83,32.7 v30.8,32.7 23.5,32.7 12.06,44.13 12.06,58.1 | 12.06,58.1 12.06,58.42 X1.C17 | IC8.2 25.08,58.1 12.06,58.1 | 151.76,65.72 v149.54,63.5 | 151.76,65.72 159.7,65.72 IC30.10 | v135.57,69.22 139.06,65.72 151.76,65.72 | v30.8,4.45 31.43,3.81 153.35,3.81 155.57,6.03 163.19,6.03 164.78,7.62 164.78,45.4 150.18,45.4 IC32.2
ALU2  (via drill 0.25)
  Top 0.127: v29.53,31.43 28.26,32.7 28.26,58.74 IC8.3 | v50.16,98.11 42.86,90.81 v42.86,63.18
  Bottom 0.127: IC26.9 39.69,31.43 v29.53,31.43 | IC28.14 149.54,103.82 96.84,103.82 94.93,101.92 77.79,101.92 76.2,100.33 52.39,100.33 v50.16,98.11 | v42.86,63.18 40.96,61.28 30.8,61.28 | IC8.3 30.8,61.28 | X1.C18 10.48,61.28 30.8,61.28
ALU3  (via drill 0.25)
  Top 0.127: v131.76,43.81 139.38,51.44 139.38,104.14 144.15,108.9 | 144.15,108.9 144.78,109.54 147.64,109.54 147.64,98.74 IC28.2 | v13.65,64.14 15.56,66.04 15.56,78.74 15.88,79.06 15.88,85.41 17.46,87 v17.46,103.19 | 144.15,108.9 v122.87,108.9
  Bottom 0.127: IC6.12 123.83,43.81 v131.76,43.81 | X1.C19 10.79,64.14 v13.65,64.14 | v17.46,103.19 22.23,107.95 117.47,107.95 118.43,108.9 v122.87,108.9
BDATA0  (via drill 0.25)
  Top 0.127: v26.04,81.6 25.08,82.55 25.08,91.76 | IC10.18 25.08,91.76 | RN1.2 25.08,103.19 25.08,91.76 | V2.2 29.53,9.21 29.53,14.61 30.16,15.24 30.16,42.55 31.43,43.81 v32.07,43.81 | v53.34,62.55 IC13.2 | IC21.2 91.76,22.54 91.76,58.74 | IC18.2 91.76,58.74 | IC14.2 91.76,84.14 91.76,69.53 | 91.76,58.74 91.76,69.53 | v114.3,69.85 IC33.1 | 91.76,69.53 v93.03,69.53 | v42.86,45.09 v42.86,58.42 44.77,60.33 v44.77,81.6
  Bottom 0.127: IC12.18 54.29,81.6 v44.77,81.6 v26.04,81.6 | v32.07,43.81 33.02,44.77 42.86,44.77 | 42.86,44.77 43.18,44.77 43.5,44.45 43.5,43.5 40.96,43.5 IC24.10 | IC18.2 92.71,60.64 91.44,61.91 88.9,61.91 88.27,61.28 80.33,61.28 78.74,62.87 53.66,62.87 v53.34,62.55 52.7,63.18 47.62,63.18 v42.86,58.42 | v114.3,69.85 113.98,69.53 v93.03,69.53 | v42.86,45.09 42.86,44.77
BDATA1  (via drill 0.25)
  Top 0.127: IC21.5 99.38,22.54 99.38,58.74 | IC18.5 99.38,58.74 | IC14.5 99.38,84.14 99.38,58.74 | IC33.4 126.05,70.8 v126.05,62.55 | RN1.3 27.62,103.19 27.62,93.66 IC10.17 27.62,91.76 27.62,78.74 28.57,77.79 v28.57,75.88 | V2.3 32.7,9.84 v32.7,19.37 32.7,38.73 v31.11,40.32 | 33.34,56.52 v34.61,57.78 | 33.34,56.52 33.34,42.86 IC24.12 | IC12.16 61.28,79.69 v61.28,77.15 | v34.61,75.88 33.34,74.61 33.34,56.52
  Bottom 0.127: v126.05,62.55 115.57,62.55 114.94,63.18 103.82,63.18 IC18.5 | v31.11,40.32 32.7,40.32 IC24.12 | IC13.4 59.69,60.96 59.69,61.91 49.53,61.91 45.4,57.78 v34.61,57.78 | v61.28,77.15 61.28,75.25 54.93,75.25 54.29,75.88 v34.61,75.88 v28.57,75.88 | IC21.5 98.74,20 94.3,20 93.66,19.37 v32.7,19.37
BDATA2  (via drill 0.25)
  Top 0.127: IC24.13 31.75,41.27 33.34,39.69 33.34,9.84 V2.4 34.61,8.57 34.61,7.94 38.73,3.81 109.54,3.81 v109.54,26.99 | IC10.16 30.16,93.66 30.16,103.19 RN1.4 33.66,108.58 33.66,111.44 33.97,111.76 88.27,111.76 88.27,110.81 92.08,107 99.38,107 99.38,93.66 IC14.10 101.28,91.76 v101.28,78.42 101.28,66.36 | IC21.10 101.28,30.16 101.28,66.36 | IC18.10 101.28,66.36
  Route15 0.127: IC13.6 65.09,61.28 65.09,79.06 IC12.14 62.55,83.5 v54.29,83.5
  Bottom 0.127: IC33.9 127.95,78.42 v101.28,78.42 | v54.29,83.5 45.72,83.5 38.1,91.12 30.8,91.12 IC10.16 | v109.54,26.99 108.9,27.62 101.92,27.62 IC21.10
BDATA3  (via drill 0.25)
  Top 0.127: V2.5 38.42,10.48 38.42,17.78 40.32,19.68 v40.32,39.05 | RN1.5 32.7,103.19 32.7,93.66 IC10.15 32.7,91.76 v32.7,78.74 | IC21.13 93.66,30.16 93.66,65.09 92.71,66.04 IC18.13 93.66,68.26 v93.66,77.15 93.66,91.76 IC14.13 | v70.8,77.79 71.12,78.11 IC12.12 | IC24.15 27.62,42.86 v27.62,77.79
  Route15 0.127: IC13.8 v75.88,66.99 75.88,75.25 IC12.12
  Bottom 0.127: v40.32,39.05 39.69,39.69 28.89,39.69 IC24.15 | v75.88,66.99 77.79,68.9 91.12,68.9 IC18.13 | IC33.12 123.51,81.6 130.18,81.6 130.49,81.28 130.49,77.79 116.2,77.79 114.94,76.52 100.97,76.52 100.33,77.15 v93.66,77.15 | 33.02,78.42 v32.7,78.74 | 33.02,78.42 64.14,78.42 64.77,77.79 v70.8,77.79 | v27.62,77.79 28.26,78.42 33.02,78.42
BDATA4  (via drill 0.25)
  Top 0.127: IC10.14 35.24,93.66 35.24,103.19 RN1.6 34.29,111.12 87,111.12 90.17,107.95 | 90.17,107.95 IC15.13 | IC12.9 71.44,72.07 v71.44,69.53 | v51.12,13.97 59.05,6.03 77.47,6.03 77.47,14.92 | 77.47,14.92 77.47,22.86 74.61,25.72 | IC25.10 74.61,25.72 | IC22.2 89.53,12.06 v89.53,13.65 | 77.47,14.92 v79.69,14.92 | v75.88,65.72 75.88,37.47 74.61,36.2 74.61,25.72 | 90.17,107.95 86.68,104.46 86.68,83.19 88.58,81.28 v88.58,68.26
  Bottom 0.127: 96.2,58.1 IC19.13 | 96.2,58.1 115.25,58.1 IC34.1 | 88.58,65.72 89.53,65.72 93.98,61.28 95.89,61.28 96.2,60.96 96.2,58.1 | 88.58,65.72 v75.88,65.72 75.25,65.72 IC13.11 v71.44,69.53 | V2.9 41.91,13.97 v51.12,13.97 | v89.53,13.65 88.27,14.92 v79.69,14.92 | 88.58,65.72 v88.58,68.26
BDATA5  (via drill 0.25)
  Top 0.127: v66.36,69.53 66.04,69.85 IC12.7 | v123.51,53.02 123.51,58.74 IC34.4 | v76.52,64.77 79.69,61.59 v79.69,55.56 78.42,54.29 v78.42,23.81 | V2.10 37.15,16.83 37.15,19.68 37.78,20.32 37.78,32.7 | 37.78,91.76 37.78,32.7 | IC10.13 37.78,91.76 | RN1.7 37.78,103.19 37.78,91.76 | v39.69,32.07 39.05,32.7 37.78,32.7 | IC22.5 94.3,14.92 91.12,14.92 91.12,17.78 90.17,18.73 87.95,18.73 v87.95,20.64 | v67.63,23.81 66.04,25.4 IC25.12 | IC15.2 88.58,101.92 v88.58,105.09
  Bottom 0.127: v66.36,69.53 IC13.13 71.12,64.77 v76.52,64.77 | IC19.2 90.81,48.9 90.17,48.9 89.85,49.21 89.85,51.12 | 89.85,51.12 89.85,51.44 110.81,51.44 111.12,51.12 119.7,51.12 121.6,53.02 v123.51,53.02 | v79.69,55.56 84.14,51.12 89.85,51.12 | IC25.12 64.77,30.48 64.45,30.48 62.87,32.07 v39.69,32.07 | v87.95,20.64 84.77,23.81 v78.42,23.81 v67.63,23.81 | v88.58,105.09 87.95,105.73 38.42,105.73 RN1.7
BDATA6  (via drill 0.25)
  Top 0.127: v98.74,48.26 v98.74,44.77 98.74,18.1 IC22.10 103.82,20 103.82,22.23 106.36,24.77 v106.36,86.68 106.36,99.06 106.05,99.38 101.92,99.38 IC15.5 | IC34.9 127.95,68.9 v127.95,83.5 | v39.05,14.61 43.5,14.61 v43.5,28.26 46.67,31.43 v46.67,44.13 46.67,48.9 47.31,49.53 47.31,57.47 47.94,58.1 47.94,60.96 47.31,61.59 47.31,72.71 v45.4,74.61 | v61.28,69.53 61.28,72.07 IC12.5 60.64,72.71 v60.64,75.88 | 40.32,93.66 IC10.12 | 40.32,93.66 40.32,103.19 RN1.8 | 40.32,93.66 40.32,78.42 v42.23,76.52 v42.23,75.25
  Bottom 0.127: v98.74,48.26 100.01,46.99 IC19.5 | v127.95,83.5 121.28,83.5 120.33,84.45 120.33,86.68 v106.36,86.68 | V2.11 36.2,14.61 v39.05,14.61 | v43.5,28.26 46.35,31.11 61.59,31.11 IC25.13 | IC13.15 v61.28,69.53 | v60.64,75.88 60.01,76.52 v42.23,76.52 | v45.4,74.61 44.77,75.25 v42.23,75.25 | v98.74,44.77 85.72,44.77 85.09,44.13 v46.67,44.13
BDATA7  (via drill 0.25)
  Top 0.127: IC25.15 57.47,28.26 v57.47,18.1 | IC10.11 42.86,93.66 42.86,103.19 | RN1.9 42.86,103.19 | v51.75,68.9 51.75,81.92 46.99,86.68 v46.99,87.63 | v48.26,108.58 42.86,103.19 | v88.9,111.12 100.33,111.12 IC15.10 100.33,102.55 103.82,102.55 107,99.38 v107,57.47 v107,20
  Route15 0.127: IC13.17 56.2,69.53 56.2,71.75 55.88,72.07 IC12.3 | IC34.12 112.08,57.47 v107,57.47
  Bottom 0.127: V2.12 33.34,18.1 v57.47,18.1 75.56,18.1 76.52,17.14 88.58,17.14 89.53,18.1 91.12,18.1 IC22.13 94.3,18.1 105.09,18.1 v107,20 | IC13.17 56.83,68.9 v51.75,68.9 | IC10.11 v46.99,87.63 | IC19.10 103.19,57.47 v107,57.47 | v48.26,108.58 50.8,111.12 v88.9,111.12
BDATA8  (via drill 0.25)
  Top 0.127: RN2.2 23.18,96.84 23.18,83.82 23.81,83.19 23.81,80.33 IC11.18 25.08,79.06 v25.08,24.45 | V1.2 56.83,13.02 56.83,14.92 51.12,20.64 v51.12,23.81
  Bottom 0.127: v51.12,23.81 50.48,24.45 v25.08,24.45
BDATA9  (via drill 0.25)
  Top 0.127: RN2.3 25.72,96.84 25.72,83.82 26.67,82.87 IC11.17 25.72,79.06 25.72,13.34 v28.57,10.48
  Bottom 0.127: V1.3 61.91,10.48 v28.57,10.48
BDATA10  (via drill 0.25)
  Top 0.127: RN2.4 28.26,96.84 28.26,80.96 IC11.16 30.16,79.06 30.16,53.98 32.7,51.44 32.7,41.27 v33.66,40.32 | V1.4 65.72,9.21 65.72,12.06 62.55,15.24 v62.55,39.05
  Bottom 0.127: v62.55,39.05 61.28,40.32 v33.66,40.32
BDATA11  (via drill 0.25)
  Top 0.127: RN2.5 30.8,96.84 30.8,83.82 31.43,83.19 31.43,80.33 IC11.15 31.75,74.93 v31.43,74.61 | v23.81,9.53 18.1,15.24 18.1,66.04 23.18,71.12 v23.18,74.61
  Bottom 0.127: V1.5 66.99,7.3 26.04,7.3 v23.81,9.53 | v31.43,74.61 v23.18,74.61
BDATA12  (via drill 0.25)
  Top 0.127: RN2.6 33.34,96.84 33.34,80.96 IC11.14 34.29,77.79 35.24,76.83 35.24,39.37 35.88,38.73 35.88,14.29 v37.15,13.02
  Bottom 0.127: V1.9 68.58,13.97 64.45,13.97 63.5,13.02 v37.15,13.02
BDATA13  (via drill 0.25)
  Top 0.127: 35.88,80.96 IC11.13 | 35.88,80.96 35.88,96.84 RN2.7 | V1.10 65.09,20 v65.09,37.78 | v37.15,38.42 35.88,39.69 35.88,80.96
  Bottom 0.127: v65.09,37.78 64.45,38.42 v37.15,38.42
BDATA14  (via drill 0.25)
  Top 0.127: RN2.8 38.42,96.84 38.42,83.82 39.05,83.19 39.05,80.33 IC11.12 39.37,78.42 40.64,77.15 40.64,45.4 42.86,43.18 v42.86,15.24
  Bottom 0.127: V1.11 63.82,14.29 57.15,14.29 56.2,15.24 v42.86,15.24
BDATA15  (via drill 0.25)
  Top 0.127: IC11.11 40.96,80.96 40.96,96.84 RN2.9 | v49.85,17.46 49.21,18.1 49.21,72.39 45.4,76.2 v45.4,79.06
  Bottom 0.127: V1.12 61.91,14.92 57.47,14.92 54.93,17.46 v49.85,17.46 | v45.4,79.06 44.45,80.01 IC11.11
BR-COND  (via drill 0.25)
  Top 0.127: v22.86,6.67 10.48,19.05 2.54,19.05 2.54,72.71 4.76,74.93 10.16,74.93 X1.C24
  Bottom 0.127: IC27.8 163.83,23.18 163.19,23.18 162.88,22.86 162.88,6.67 v22.86,6.67
C/SHIFT  (via drill 0.25)
  Top 0.127: 153.67,100.33 IC28.3 | IC28.13 153.67,100.33 | IC9.5 171.45,46.99 SV1.9 170.18,54.61 170.18,100.33 153.67,100.33 | v44.13,26.99 47.31,30.16 v47.31,45.4 | v111.44,45.4 119.38,45.4 IC6.13
  Bottom 0.127: IC26.12 32.7,30.8 31.11,30.8 30.8,30.48 30.8,26.99 v44.13,26.99 | v47.31,45.4 v111.44,45.4 132.72,45.4 140.34,53.02 171.13,53.02 SV1.9
CO/BO  (via drill 0.25)
  Top 0.127: v139.06,31.43 145.1,25.4 145.1,16.51 148.59,13.02 IC7.1
  Bottom 0.127: IC1.10 129.22,31.43 v139.06,31.43
DATA0  (via drill 0.25)
  Top 0.127: v13.97,65.41 v13.97,84.14
  Bottom 0.127: IC10.2 20,86.68 18.1,86.68 15.56,84.14 v13.97,84.14 | v13.97,65.41 13.34,64.77 6.35,64.77 X1.A19
DATA1  (via drill 0.25)
  Top 0.127: v12.06,81.92 11.43,81.28 11.43,68.26 10.48,67.31 5.08,67.31 X1.A20
  Bottom 0.127: IC10.3 24.13,82.87 22.23,82.87 21.27,81.92 v12.06,81.92
DATA2  (via drill 0.25)
  Top 0.127: v13.97,85.09 13.34,84.45 v13.34,73.03
  Bottom 0.127: IC10.4 24.45,87.31 17.78,87.31 15.56,85.09 v13.97,85.09 | v13.34,73.03 13.34,69.85 6.35,69.85 X1.A21
DATA3  (via drill 0.25)
  Top 0.127: v14.61,75.25 v14.61,88.58
  Bottom 0.127: IC10.5 26.35,87.95 17.78,87.95 17.14,88.58 v14.61,88.58 | v14.61,75.25 11.75,72.39 6.35,72.39 X1.A22
DATA4  (via drill 0.25)
  Top 0.127: v22.54,75.88 v22.54,81.28
  Bottom 0.127: IC10.6 28.89,82.23 23.5,82.23 v22.54,81.28 | v22.54,75.88 11.43,75.88 10.48,74.93 6.35,74.93 X1.A23
DATA5  (via drill 0.25)
  Top 0.127: IC10.7 35.24,84.14 v35.24,77.79
  Bottom 0.127: v35.24,77.79 33.97,76.52 11.43,76.52 10.48,77.47 6.35,77.47 X1.A24
DATA6  (via drill 0.25)
  Top 0.127: v20,88.58 16.51,85.09 v16.51,81.28
  Bottom 0.127: IC10.8 33.34,88.58 v20,88.58 | v16.51,81.28 15.24,80.01 6.35,80.01 X1.A25
DATA7
  Bottom 0.127: IC10.9 35.24,89.22 12.06,89.22 10.48,87.63 4.76,87.63 3.81,86.68 3.81,81.28 X1.A26
DATA8  (via drill 0.25)
  Top 0.127: IC11.2 21.59,77.79 20,79.38 v20,82.55
  Bottom 0.127: v20,82.55 6.35,82.55 X1.A27
DATA9  (via drill 0.25)
  Top 0.127: IC11.3 23.81,72.71 23.81,78.11 23.18,78.74 23.18,81.6 v21.59,83.19
  Bottom 0.127: v21.59,83.19 21.27,83.5 12.06,83.5 10.48,85.09 6.35,85.09 X1.A28
DATA10  (via drill 0.25)
  Top 0.127: v30.8,70.8 30.8,82.87 30.16,83.5 v30.16,89.85
  Bottom 0.127: IC11.4 28.26,70.8 v30.8,70.8 | v30.16,89.85 28.89,91.12 11.43,91.12 10.48,90.17 6.35,90.17 X1.A29
DATA11  (via drill 0.25)
  Top 0.127: v29.21,77.15 IC11.5 | v15.24,79.38 15.24,88.9 13.97,90.17 5.08,90.17 X1.A30
  Bottom 0.127: v29.21,77.15 18.41,77.15 16.19,79.38 v15.24,79.38
DATA12  (via drill 0.25)
  Top 0.127: IC11.6 31.43,72.07 31.43,69.22 30.8,68.58 v30.8,63.18
  Bottom 0.127: v30.8,63.18 11.43,63.18 10.48,62.23 7.3,62.23 6.35,61.28 6.35,54.61 10.48,54.61 11.43,53.66 11.43,24.13 8.89,24.13 X1.B3
DATA13  (via drill 0.25)
  Top 0.127: v20.95,73.98 20,73.03 20,68.9 17.46,66.36 17.46,33.66 10.48,26.67 7.62,26.67 X1.B4
  Bottom 0.127: IC11.7 32.7,73.98 v20.95,73.98
DATA14  (via drill 0.25)
  Top 0.127: v19.37,70.17 16.19,66.99 16.19,53.34 13.02,50.16 13.02,31.75 10.48,29.21 7.62,29.21 X1.B5
  Bottom 0.127: IC11.8 34.61,70.17 v19.37,70.17
DATA15  (via drill 0.25)
  Top 0.127: v11.75,66.67 11.43,66.36 11.43,32.7 10.48,31.75 7.62,31.75 X1.B6
  Bottom 0.127: IC11.9 36.51,69.53 16.19,69.53 13.34,66.67 v11.75,66.67
GND
  pour Route15: 0,113.03 0,105.41 6.35,105.41 6.35,97.79 0,97.79 0,16.51 6.35,16.51 6.35,8.89 0,8.89 0,0 177.8,0 177.8,113.03
IN  (via drill 0.25)
  Top 0.127: v12.38,42.86 12.38,81.28 12.7,81.6 12.7,82.23 12.38,82.55 10.16,82.55 X1.C26
  Bottom 0.127: IC26.14 26.99,31.43 23.81,31.43 v12.38,42.86
INV-IN0  (via drill 0.25)
  Top 0.127: IC23.18 55.88,44.45 IC2.2 52.39,47.94 52.39,56.2 52.07,56.52 | 52.07,56.52 v51.44,57.15 | 53.02,64.77 52.07,63.82 52.07,56.52 | 53.02,64.77 53.34,65.09 | 53.34,65.09 v54.29,66.04 | IC20.18 87.63,47.94 88.58,48.9 v88.58,63.18 | 53.02,64.77 v54.29,63.5 | IC37.18 147,80.96 147,91.76 IC31.18 | IC17.18 54.93,103.19 54.93,86.68 IC3.2 52.39,84.14 52.39,66.04 53.34,65.09
  Bottom 0.127: IC16.18 26.67,57.15 v51.44,57.15 | IC13.18 54.61,66.04 v54.29,66.04 | v88.58,63.18 88.27,63.5 v54.29,63.5 | IC31.18 144.46,94.3 126.36,94.3 125.41,93.34 125.41,91.12 104.46,91.12 103.19,89.85 88.9,89.85 88.27,89.22 57.47,89.22 IC3.2
INV-IN1  (via drill 0.25)
  Top 0.127: IC37.16 152.08,80.96 152.08,91.76 IC31.16 150.18,93.66 v150.18,108.9 | IC2.4 57.47,47.94 57.47,56.52 | 57.47,84.14 57.47,68.9 | 57.47,68.9 57.47,56.52 | IC3.4 57.47,84.14 | 57.47,56.52 v56.52,56.52 | IC23.16 60.01,42.86 v60.01,48.26 | 57.47,68.9 v57.78,68.9 | 57.47,84.14 57.47,100.65 IC17.16 60.96,107 83.19,107 v86.68,110.49
  Route15 0.127: IC20.16 90.81,43.81 90.81,44.13 v88.58,46.35
  Bottom 0.127: IC16.16 31.11,56.52 v56.52,56.52 | IC2.4 58.74,46.99 v60.01,48.26 60.33,48.58 74.3,48.58 74.93,47.94 87,47.94 v88.58,46.35 | IC13.16 59.37,68.9 v57.78,68.9 | v150.18,108.9 148.27,110.81 89.53,110.81 89.22,110.49 v86.68,110.49
INV-IN2  (via drill 0.25)
  Top 0.127: IC37.14 157.16,80.96 157.16,90.49 156.21,91.44 IC31.14 | IC2.6 62.55,47.94 v62.55,64.77 62.55,84.14 | IC3.6 62.55,84.14 | 64.45,105.73 IC17.14 | 64.45,105.73 62.55,105.73 62.55,84.14 | v88.58,108.58 85.72,108.58 83.5,106.36 64.45,106.36 64.45,105.73
  Route15 0.127: IC16.14 37.78,58.1 37.78,60.33 v41.91,64.45 | IC23.14 63.82,44.13 63.82,46.35 63.5,46.67 IC2.6
  Bottom 0.127: v41.91,64.45 46.35,64.45 47.62,65.72 49.21,65.72 50.16,64.77 v62.55,64.77 63.5,64.77 IC13.14 | IC23.14 67.63,40.32 96.2,40.32 IC20.14 | IC31.14 159.7,96.2 161.93,96.2 162.24,96.52 162.24,107.63 125.09,107.63 123.19,109.54 104.78,109.54 103.82,108.58 v88.58,108.58
INV-IN3  (via drill 0.25)
  Top 0.127: IC31.12 162.24,91.76 162.24,80.96 IC37.12 162.24,79.06 v162.24,44.77 | IC16.12 40.01,53.98 v40.01,48.9 | IC2.8 68.58,48.9 v67.63,49.85 67.63,68.58 | v72.07,38.42 71.12,39.37 IC23.12 | 67.63,68.58 v67.94,68.9 | 67.63,68.58 67.63,84.14 IC3.8 69.53,86.04 69.53,97.16 70.8,98.42 70.8,103.82 IC17.12
  Route15 0.127: IC23.12 68.9,44.13 68.9,46.35 68.58,46.67 IC2.8
  Bottom 0.127: v40.01,48.9 40.32,48.58 51.44,48.58 52.7,49.85 v67.63,49.85 | v72.07,38.42 80.64,38.42 81.92,39.69 100.65,39.69 IC20.12 105.73,44.77 v162.24,44.77 | IC13.12 69.53,68.9 v67.94,68.9
INV-IN4  (via drill 0.25)
  Top 0.127: IC37.9 160.34,73.34 160.34,84.14 IC31.9 | IC17.9 73.66,93.98 IC3.11 74.61,91.76 v74.61,88.58 74.61,58.42 73.66,57.47 | v39.37,50.48 IC16.9 | 73.66,57.47 v73.34,57.78 | IC2.11 73.66,57.47 | IC23.9 70.17,35.24 v70.17,49.85
  Bottom 0.127: IC23.9 72.71,32.7 101.28,32.7 IC20.9 | 69.53,50.48 v39.37,50.48 | IC2.11 69.53,50.48 | IC13.9 73.03,57.78 v73.34,57.78 | IC31.9 157.8,88.58 113.35,88.58 112.71,89.22 89.22,89.22 88.58,88.58 v74.61,88.58 | 69.53,50.48 v70.17,49.85
INV-IN5  (via drill 0.25)
  Top 0.127: IC23.7 66.99,35.24 v66.99,51.12 | IC20.7 97.47,33.97 v97.47,31.75 | IC37.7 155.26,73.34 155.26,84.14 IC31.7 | IC3.13 66.04,95.25 IC17.7 70.17,100.65 70.17,105.41 70.48,105.73 75.25,105.73 75.25,70.17 | v75.25,62.23 75.25,70.17 | 75.25,70.17 v79.69,70.17
  Route2 0.127: IC16.7 40.32,53.02 43.81,53.02 v48.58,57.78
  Bottom 0.127: 66.99,53.02 66.99,54.61 IC2.13 | 66.99,53.02 v66.99,51.12 | v97.47,31.75 68.58,31.75 IC23.7 | v48.58,57.78 48.9,58.1 60.01,58.1 | 60.01,58.1 64.45,58.1 IC13.7 67.63,61.28 74.3,61.28 v75.25,62.23 | IC37.7 154.31,70.48 93.98,70.48 93.66,70.17 v79.69,70.17 | 66.99,53.02 60.33,53.02 60.01,53.34 60.01,58.1
INV-IN6  (via drill 0.25)
  Top 0.127: IC31.5 150.18,84.14 150.18,73.34 IC37.5 150.18,71.44 150.18,50.16 152.72,47.62 v152.72,40.64 | IC23.5 61.91,35.24 61.91,43.18 64.45,45.72 64.45,49.85 v63.18,51.12 63.5,51.44 IC2.15 64.45,55.56 64.45,60.96 | 64.45,60.96 v64.14,61.28 | IC20.5 92.39,33.97 v92.39,31.11 | IC3.15 64.45,91.76 64.45,60.96
  Bottom 0.127: IC17.5 63.5,93.98 IC3.15 | IC16.5 33.34,51.12 v63.18,51.12 | IC13.5 62.55,61.28 v64.14,61.28 | IC23.5 62.55,32.7 63.18,32.7 64.77,31.11 v92.39,31.11 111.44,31.11 115.57,26.99 133.03,26.99 133.67,27.62 152.72,27.62 v152.72,40.64
INV-IN7  (via drill 0.25)
  Top 0.127: IC37.3 145.1,73.34 145.1,84.14 IC31.3 145.1,86.04 v145.1,108.9 | IC23.3 57.47,35.88 57.47,43.81 59.37,45.72 59.37,53.66 | IC2.17 59.37,53.66 | 59.37,60.96 v59.05,61.28 | 59.37,53.66 59.37,60.96 | IC3.17 59.37,91.76 59.37,60.96 | v85.09,109.86 56.83,109.86 56.83,97.47 IC17.3
  Bottom 0.127: IC17.3 58.42,93.98 IC3.17 | IC16.3 29.53,52.39 46.99,52.39 47.62,53.02 56.83,53.02 IC2.17 | IC13.3 57.47,61.28 v59.05,61.28 | IC20.3 86.04,35.88 76.2,35.88 75.56,36.51 58.1,36.51 IC23.3 | v145.1,108.9 143.83,110.17 104.46,110.17 104.14,109.86 v85.09,109.86
N$1  (via drill 0.25)
  Top 0.127: IC27.4 152.72,25.08 152.72,39.37 152.08,40.01 152.08,43.18 149.86,45.4 141.6,45.4 v141.6,54.29
  Bottom 0.127: v141.6,54.29 141.29,54.61 IC36.9
N$2  (via drill 0.25)
  Top 0.127: IC27.3 155.26,20 157.16,20 157.16,35.56 162.88,41.27 v162.88,81.28
  Bottom 0.127: v162.88,81.28 161.29,82.87 148.91,82.87 148.27,83.5 131.13,83.5 IC35.7
N$3
  Top 0.127: IC4.3 122.87,9.84 122.87,30.8 123.51,31.43 123.51,35.88 IC6.9
N$4  (via drill 0.25)
  Top 0.127: IC26.7 38.42,20.64 v38.42,18.73
  Bottom 0.127: v38.42,18.73 25.08,18.73 JP1.2
N$5
  Bottom 0.127: IC6.8 134.3,44.13 156.21,44.13 157.16,43.18 157.16,36.2 154.31,36.2 153.67,35.56 IC9.3
N$6  (via drill 0.25)
  Top 0.127: V2.13 27.62,18.1 27.62,28.26 IC26.15 | IC6.4 124.14,33.97 124.14,31.11 123.51,30.48 123.51,8.26 116.52,1.27 30.16,1.27 v30.16,11.11
  Bottom 0.127: v30.16,11.11 30.16,16.51 V2.13
N$7
  Top 0.127: IC7.3 152.08,10.48 152.08,33.34 IC9.2
N$8  (via drill 0.25)
  Top 0.127: v148.59,31.43 149.54,30.48 149.54,22.54 IC27.1
  Bottom 0.127: IC6.11 129.54,36.83 143.19,36.83 v148.59,31.43
N$9
  Bottom 0.127: IC6.10 130.81,38.1 JP2.2
N$10
  Bottom 0.127: IC4.5 138.11,20 159.7,20 IC27.6
N$11
  Top 0.127: IC9.12 155.26,40.32 160.34,40.32 160.34,46.04 IC32.7
N$12  (via drill 0.25)
  Top 0.127: IC35.2 120.33,81.6 v120.33,76.52
  Bottom 0.127: v120.33,76.52 122.87,73.98 127.95,73.98 IC33.6
N$13  (via drill 0.25)
  Top 0.127: IC36.2 118.43,48.58 v118.43,57.47
  Bottom 0.127: v118.43,57.47 119.06,58.1 127.95,58.1 IC34.6
N$14
  Bottom 0.127: R1.1 155.89,4.76 174.31,4.76 PWR.A
N$15
  Top 0.127: IC4.4 126.05,7.3 131.13,7.3 131.13,28.26 IC1.8
N$16
  Top 0.127: IC4.6 125.41,13.02 125.41,28.26 IC1.11
N$26  (via drill 0.25)
  Top 0.127: IC35.15 119.7,89.85 v119.7,87.95 | v129.22,87.95 131.13,86.04 131.13,80.96 IC33.8
  Bottom 0.127: v129.22,87.95 v119.7,87.95
N$27
  Top 0.127: IC33.11 125.41,80.96 125.41,91.12 IC35.11
N$28
  Top 0.127: IC33.3 122.87,73.34 122.87,75.56 126.05,78.74 126.05,84.14 IC35.6
N$29
  Top 0.127: IC36.6 122.87,51.12 122.87,58.74 IC34.3
N$31  (via drill 0.25)
  Top 0.127: IC36.15 117.79,55.56 v117.79,64.45
  Bottom 0.127: v117.79,64.45 119.06,65.72 130.49,65.72 IC34.8
N$32
  Top 0.127: IC36.11 125.41,56.2 125.41,66.36 IC34.11
N$33  (via drill 0.25)
  Top 0.127: IC35.4 120.97,84.14 v120.97,69.85 | v142.56,69.85 143.51,70.8 IC37.2
  Bottom 0.127: v142.56,69.85 v120.97,69.85
N$34  (via drill 0.25)
  Top 0.127: IC35.1 118.43,80.96 v118.43,77.15 | v146.69,78.42 148.59,76.52 IC37.4
  Bottom 0.127: v118.43,77.15 136.53,77.15 137.79,78.42 v146.69,78.42
N$35  (via drill 0.25)
  Top 0.127: IC35.13 122.24,92.39 122.24,87 122.87,86.36 v122.87,76.52 | v153.35,75.88 153.67,75.56 IC37.6
  Bottom 0.127: v122.87,76.52 123.51,75.88 v153.35,75.88
N$36  (via drill 0.25)
  Top 0.127: v157.48,91.12 157.8,90.81 157.8,73.34 IC37.8
  Bottom 0.127: IC35.10 131.13,91.12 v157.48,91.12
N$37  (via drill 0.25)
  Top 0.127: v133.67,50.16 137.48,53.98 v137.48,71.12
  Bottom 0.127: IC36.4 125.09,50.16 v133.67,50.16 | v137.48,71.12 141.6,75.25 159.07,75.25 IC37.11
N$38  (via drill 0.25)
  Top 0.127: IC36.1 112.71,48.58 112.71,77.47 111.44,78.74 v111.44,82.87
  Bottom 0.127: v111.44,82.87 147.96,82.87 149.22,81.6 157.16,81.6 IC37.13
N$39  (via drill 0.25)
  Top 0.127: IC36.13 121.6,54.93 121.6,57.78 120.97,58.42 120.97,68.9 123.51,71.44 123.51,73.66 v126.36,76.52
  Bottom 0.127: v126.36,76.52 150.18,76.52 IC37.15
N$40  (via drill 0.25)
  Top 0.127: IC36.10 130.49,55.56 v130.49,57.78 | v143.19,58.1 147.64,58.1 147.64,69.22 149.54,71.12 149.54,79.06 IC37.17
  Bottom 0.127: v130.49,57.78 130.81,58.1 v143.19,58.1
N$41  (via drill 0.25)
  Top 0.127: v131.76,48.9 133.03,50.16 133.03,91.76 IC35.9
  Bottom 0.127: IC36.7 131.44,48.9 v131.76,48.9
N$43  (via drill 0.25)
  Top 0.127: IC24.5 35.24,33.34 v35.24,25.08 | v63.18,25.08 63.5,24.77 IC25.4
  Bottom 0.127: v63.18,25.08 v35.24,25.08
N$45  (via drill 0.25)
  Top 0.127: v59.05,32.7 60.01,31.75 60.01,22.54 IC25.3
  Bottom 0.127: IC24.6 38.42,32.7 v59.05,32.7
N$46  (via drill 0.25)
  Top 0.127: v51.44,35.88 52.39,34.92 52.39,20.32 57.78,14.92 59.37,14.92 59.37,20.64 IC25.2
  Bottom 0.127: IC24.7 40.96,35.88 v51.44,35.88
N$47
  Bottom 0.127: IC26.3 30.8,20 69.53,20 IC25.7
N$48  (via drill 0.25)
  Top 0.127: v66.67,25.72 68.58,23.81 IC25.6
  Bottom 0.127: IC26.2 25.08,20 23.5,20 23.18,20.32 23.18,25.72 v66.67,25.72
N$49
  Bottom 0.127: IC26.1 25.72,23.18 64.45,23.18 IC25.5
N$52  (via drill 0.25)
  Top 0.127: V1.13 61.28,16.19 61.28,10.79 62.55,9.53 62.55,7.62 63.5,6.67 76.83,6.67 v76.83,18.73 | v126.36,13.02 126.05,13.34 126.05,33.34 IC6.5
  Bottom 0.127: v76.83,18.73 95.57,18.73 96.2,19.37 105.41,19.37 106.68,20.64 107.31,20.64 107.63,20.32 107.63,13.02 v126.36,13.02
N$55  (via drill 0.25)
  Top 0.127: v128.59,24.45 128.59,33.34 IC6.6
  Bottom 0.127: IC26.13 33.34,27.62 57.78,27.62 59.05,26.35 83.82,26.35 87,23.18 125.09,23.18 126.36,24.45 v128.59,24.45
N$56  (via drill 0.25)
  Top 0.127: IC26.5 35.24,20.64 35.24,8.26 v39.05,4.45 | v152.4,4.45 155.26,7.3 155.26,13.34 157.8,15.88 157.8,28.26 IC27.10
  Bottom 0.127: v152.4,4.45 v39.05,4.45
N$66
  Top 0.127: IC29.14 120.33,106.36 120.33,107.31 123.19,110.17 149.54,110.17 149.54,86.04 IC31.4
N$69  (via drill 0.25)
  Top 0.127: IC29.13 122.87,104.46 v122.87,90.49
  Bottom 0.127: v122.87,90.49 124.14,89.22 159.38,89.22 162.24,86.36 162.24,83.5 155.26,83.5 IC31.6
N$70  (via drill 0.25)
  Top 0.127: IC29.12 127.95,101.92 v127.95,87.31
  Bottom 0.127: v127.95,87.31 128.59,86.68 157.16,86.68 IC31.8
N$71  (via drill 0.25)
  Top 0.127: v163.51,69.22 164.78,70.48 164.78,91.76 IC31.11
  Bottom 0.127: IC30.15 150.5,69.22 v163.51,69.22
N$72  (via drill 0.25)
  Top 0.127: IC30.14 152.08,68.26 v152.08,71.12
  Bottom 0.127: v152.08,71.12 152.08,74.61 160.66,74.61 164.78,78.74 164.78,91.12 160.34,91.12 IC31.13
N$73
  Top 0.127: IC30.13 152.72,68.26 152.72,91.76 IC31.15
N$75
  Bottom 0.127: IC29.2 118.43,99.38 159.7,99.38 IC28.7
N$76  (via drill 0.25)
  Top 0.127: IC30.7 161.61,60.01 v161.61,63.5
  Bottom 0.127: v161.61,63.5 163.83,65.72 164.47,65.72 165.42,66.67 165.42,105.41 IC28.9
N$77  (via drill 0.25)
  Top 0.127: IC23.2 56.83,30.8 v56.83,24.45
  Bottom 0.127: v56.83,24.45 57.47,23.81 66.67,23.81 67.31,23.18 84.45,23.18 87.63,20 93.34,20 94.93,21.59 IC21.3
N$78  (via drill 0.25)
  Top 0.127: IC23.4 58.42,31.43 v59.37,30.48 | v100.01,25.72 102.87,22.86 IC21.6
  Bottom 0.127: v59.37,30.48 59.37,26.99 85.72,26.99 87,25.72 v100.01,25.72
N$79  (via drill 0.25)
  Top 0.127: IC23.6 63.82,34.61 v63.82,37.15 | v104.14,36.83 104.46,36.51 104.46,30.16 IC21.8
  Bottom 0.127: v63.82,37.15 78.74,37.15 79.38,37.78 94.93,37.78 95.89,36.83 v104.14,36.83
N$81  (via drill 0.25)
  Top 0.127: v75.25,35.88 77.79,33.34 v77.79,29.21
  Bottom 0.127: IC23.8 70.17,35.88 v75.25,35.88 | v77.79,29.21 78.74,28.26 88.9,28.26 89.53,27.62 96.2,27.62 IC21.11
N$82  (via drill 0.25)
  Top 0.127: IC22.3 93.66,7.3 81.92,7.3 81.92,32.7 81.6,33.02 81.6,41.27 v81.28,41.59
  Bottom 0.127: v81.28,41.59 80.96,41.91 IC23.11
N$83  (via drill 0.25)
  Top 0.127: IC23.13 67.63,40.96 v67.63,25.72 | v79.06,24.45 80.33,23.18 80.33,7.3 80.96,6.67 102.87,6.67 IC22.6
  Bottom 0.127: v67.63,25.72 68.9,24.45 v79.06,24.45
N$84  (via drill 0.25)
  Top 0.127: IC23.15 64.45,40.96 64.45,15.24 v66.36,13.34
  Bottom 0.127: v66.36,13.34 69.22,10.48 99.38,10.48 IC22.8
N$85  (via drill 0.25)
  Top 0.127: IC23.17 60.01,40.32 60.01,32.7 61.91,30.8 v61.91,27.94 | v83.19,27.62 86.68,24.13 86.68,22.86 90.17,19.37 97.79,19.37 IC22.11
  Bottom 0.127: v61.91,27.94 62.23,27.62 v83.19,27.62
N$86  (via drill 0.25)
  Top 0.127: IC20.2 86.04,35.24 v86.04,56.83
  Bottom 0.127: v86.04,56.83 87.31,58.1 93.66,58.1 IC18.3
N$87  (via drill 0.25)
  Top 0.127: IC20.4 91.12,35.24 v91.12,39.05 | v102.55,39.05 103.82,40.32 103.82,58.74 IC18.6
  Bottom 0.127: v102.55,39.05 v91.12,39.05
N$88  (via drill 0.25)
  Top 0.127: IC20.6 96.2,35.24 v96.2,37.47 | v110.81,64.45 v110.81,37.78
  Bottom 0.127: v96.2,37.47 96.52,37.78 v110.81,37.78 | v110.81,64.45 107.95,67.31 IC18.8
N$89  (via drill 0.25)
  Top 0.127: v102.55,36.2 104.46,38.1 v104.46,64.45
  Bottom 0.127: IC20.8 102.23,36.2 v102.55,36.2 | v104.46,64.45 103.19,65.72 99.38,65.72 IC18.11
N$90
  Route15 0.127: IC20.11 101.92,45.4 101.92,50.48 IC19.11
N$91  (via drill 0.25)
  Top 0.127: IC19.3 95.57,46.67 v95.57,44.13
  Bottom 0.127: v95.57,44.13 96.2,43.5 98.74,43.5 IC20.13
N$92  (via drill 0.25)
  Top 0.127: IC20.15 96.2,42.86 v96.2,48.26
  Bottom 0.127: v96.2,48.26 96.84,48.9 100.65,48.9 102.55,46.99 IC19.6
N$93  (via drill 0.25)
  Top 0.127: IC20.17 91.12,42.86 v91.12,50.16 | v105.09,50.16 105.41,50.48 IC19.8
  Bottom 0.127: v105.09,50.16 v91.12,50.16
N$94  (via drill 0.25)
  Top 0.127: v59.05,98.11 60.01,97.16 v60.01,88.58
  Bottom 0.127: IC17.2 54.93,98.11 v59.05,98.11 | v60.01,88.58 60.64,87.95 85.72,87.95 87,86.68 93.66,86.68 IC14.3
N$95  (via drill 0.25)
  Top 0.127: v104.14,98.74 103.82,98.42 103.82,86.04 IC14.6
  Bottom 0.127: IC17.4 61.59,99.69 86.68,99.69 87,99.38 103.5,99.38 v104.14,98.74
N$96
  Bottom 0.127: IC17.6 65.72,94.3 69.22,94.3 70.17,93.34 70.17,91.12 88.58,91.12 89.22,90.49 102.87,90.49 105.09,92.71 IC14.8
N$97
  Bottom 0.127: IC17.8 70.8,94.3 86.36,94.3 89.53,91.12 96.2,91.12 IC14.11
N$98
  Bottom 0.127: IC17.11 73.98,104.46 88.9,104.46 89.53,103.82 95.89,103.82 97.47,105.41 IC15.11
N$99  (via drill 0.25)
  Top 0.127: IC15.3 v90.49,102.55
  Bottom 0.127: IC17.13 70.17,102.55 85.72,102.55 87,103.82 88.58,103.82 89.85,102.55 v90.49,102.55
N$100  (via drill 0.25)
  Top 0.127: IC17.15 63.82,103.82 v63.82,99.06
  Bottom 0.127: v63.82,99.06 64.14,98.74 87,98.74 89.53,96.2 101.28,96.2 IC15.6
N$101  (via drill 0.25)
  Top 0.127: IC17.17 58.74,104.46 v58.74,108.58 | v100.97,109.22 105.41,109.22 IC15.8
  Bottom 0.127: v58.74,108.58 59.37,109.22 v100.97,109.22
SHIFT-OUT
  Bottom 0.127: IC7.2 157.8,15.56 157.8,19.37 161.29,19.37 162.24,20.32 162.24,41.91 IC9.9
SR-LD  (via drill 0.25)
  Top 0.127: IC1.6 130.49,22.54 130.49,35.56 131.13,36.2 | v133.67,38.73 131.13,36.2 | IC30.11 157.16,65.72 157.16,42.86 IC9.11 | IC29.11 128.59,103.82 128.59,70.48 131.13,67.94 131.13,36.2
  Bottom 0.127: v133.67,38.73 138.43,43.5 154.62,43.5 IC9.11
SRD0  (via drill 0.25)
  Top 0.127: v148.91,49.53 141.92,56.52 141.92,76.2 144.46,78.74 144.46,84.14 | IC31.2 144.46,84.14 | 144.46,84.14 v144.46,107
  Bottom 0.127: IC29.15 118.43,107 v144.46,107 157.16,107 IC28.11 | IC32.4 151.13,49.53 v148.91,49.53
SRD7
  Top 0.127: IC32.5 155.26,47.94 155.26,66.36 IC30.12 154.62,68.9 154.62,96.2 IC28.5
  Bottom 0.127: IC31.17 152.08,96.2 154.62,96.2 IC28.5
SUB  (via drill 0.25)
  Top 0.127: IC34.2 IC34.13 IC33.2 IC33.13 | IC33.10 IC33.5 IC34.10 IC34.5 128.59,58.1 128.59,45.09 130.49,43.18 130.49,37.47 127.95,34.92 v127.95,23.81
  Bottom 0.127: IC34.13 120.97,68.9 125.41,68.9 IC34.10 | IC1.4 126.05,23.18 127.95,23.18 | 149.54,23.18 127.95,23.18 | IC27.2 149.54,23.18 | IC27.5 157.16,23.18 149.54,23.18 | 127.95,23.18 v127.95,23.81
VCC
  pour Route2: 0,113.03 0,105.41 6.35,105.41 6.35,97.79 0,97.79 0,16.51 6.35,16.51 6.35,8.89 0,8.89 0,0 177.8,0 177.8,113.03

## Text on the board
tNames: YACC1 ALU BOARD V3.2 | AC-LD | -AC-LD | -ALU-FUNC | GND | onepagecomputer.com